# EAGLE board core (EAGLE 9.6.2), part 1 of 2
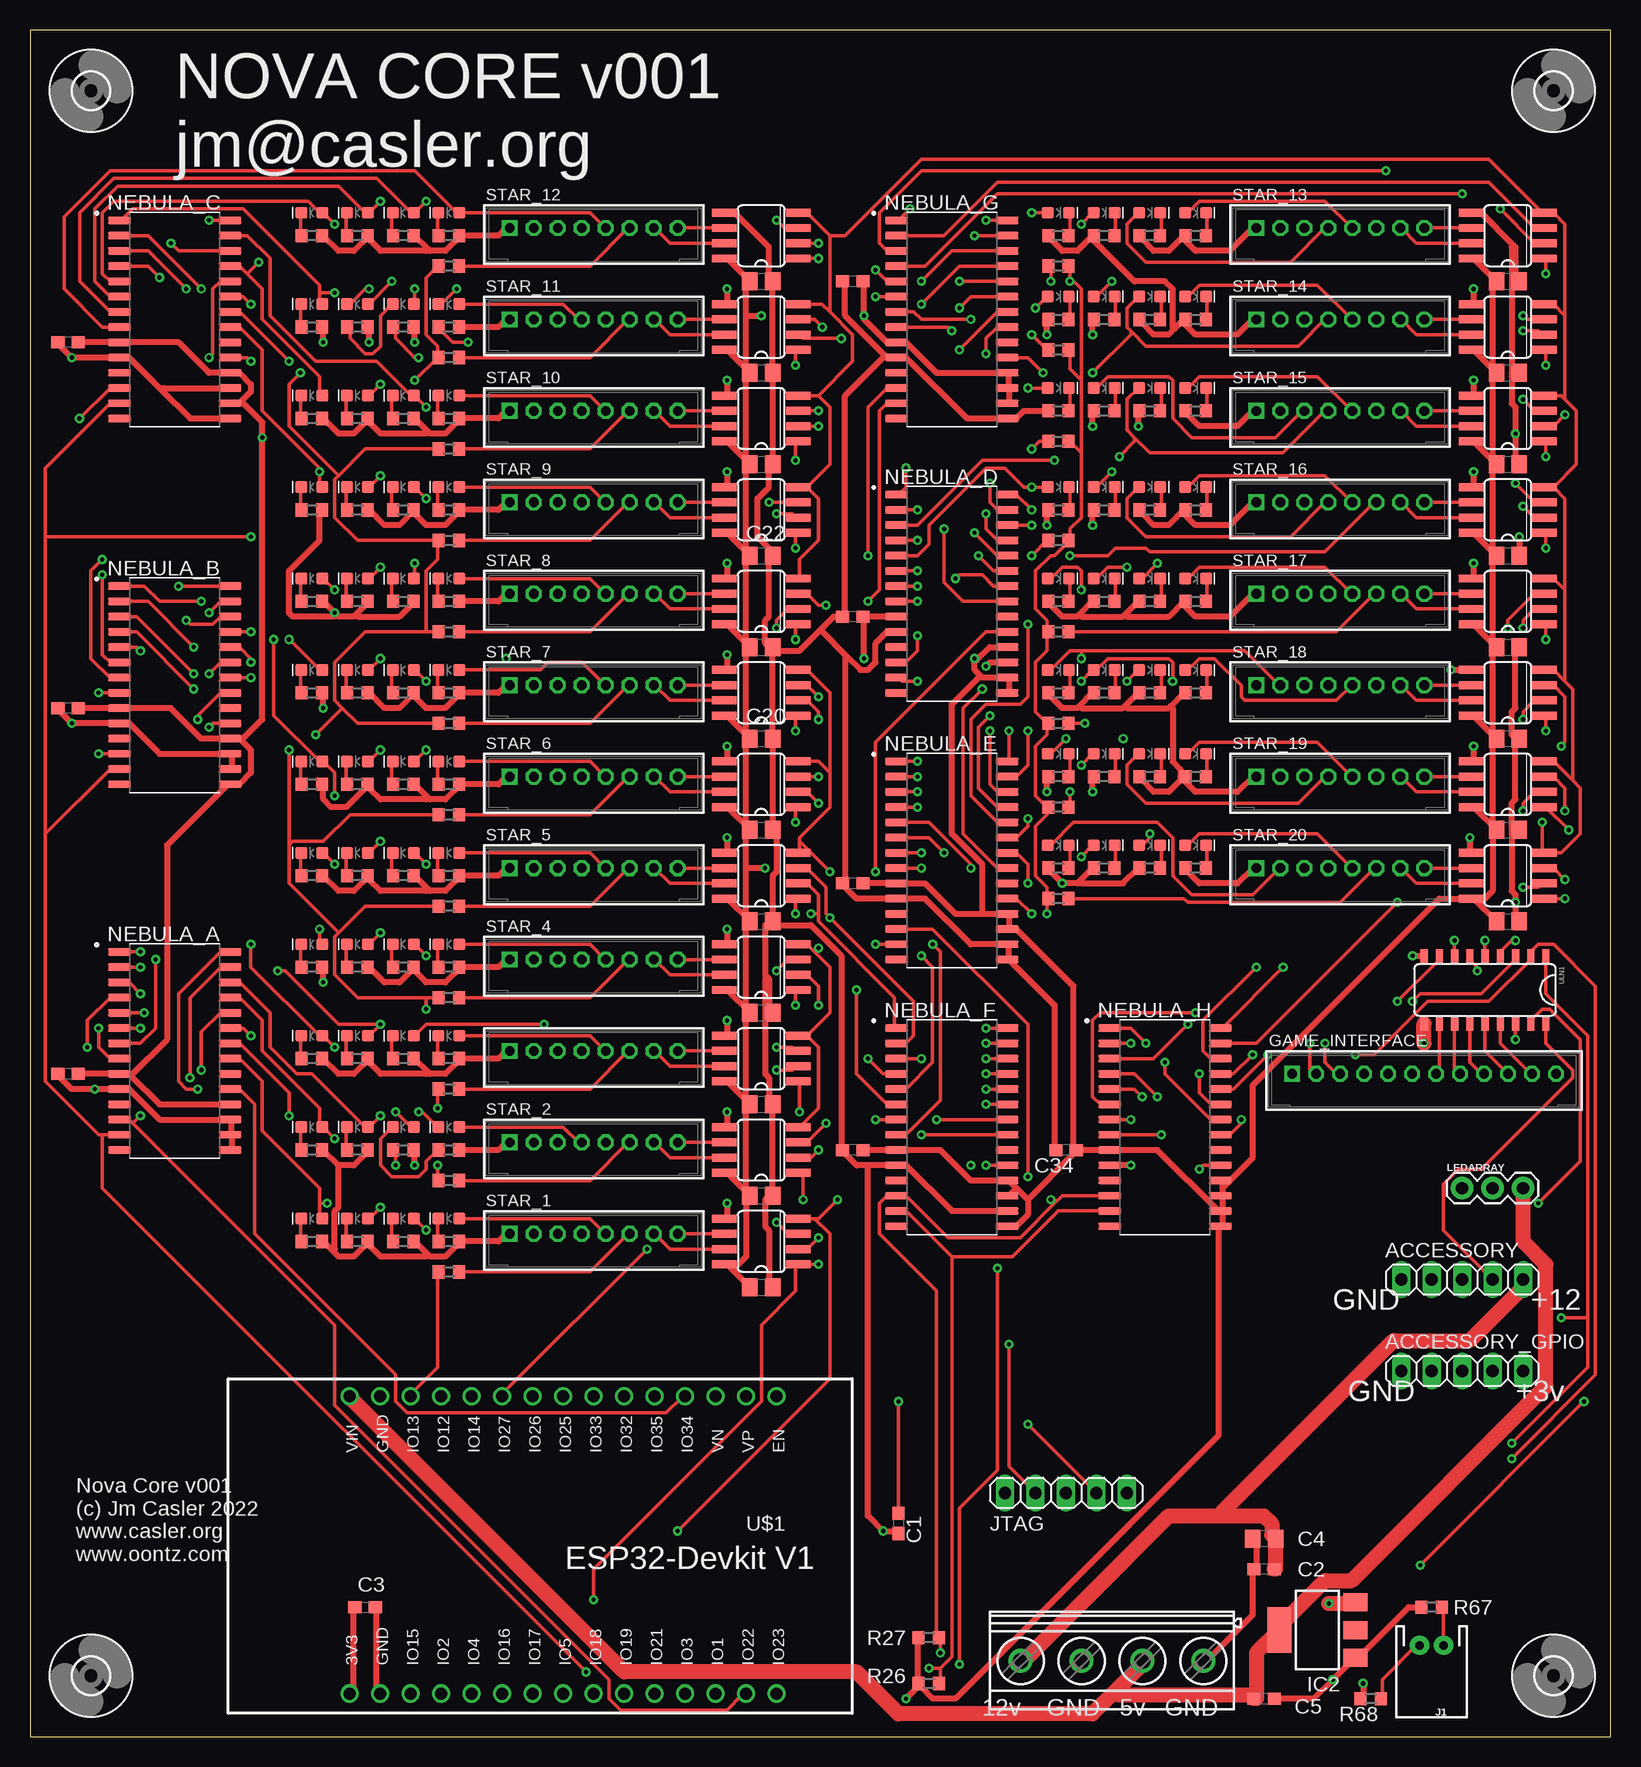
[diagram p5: board, top side]
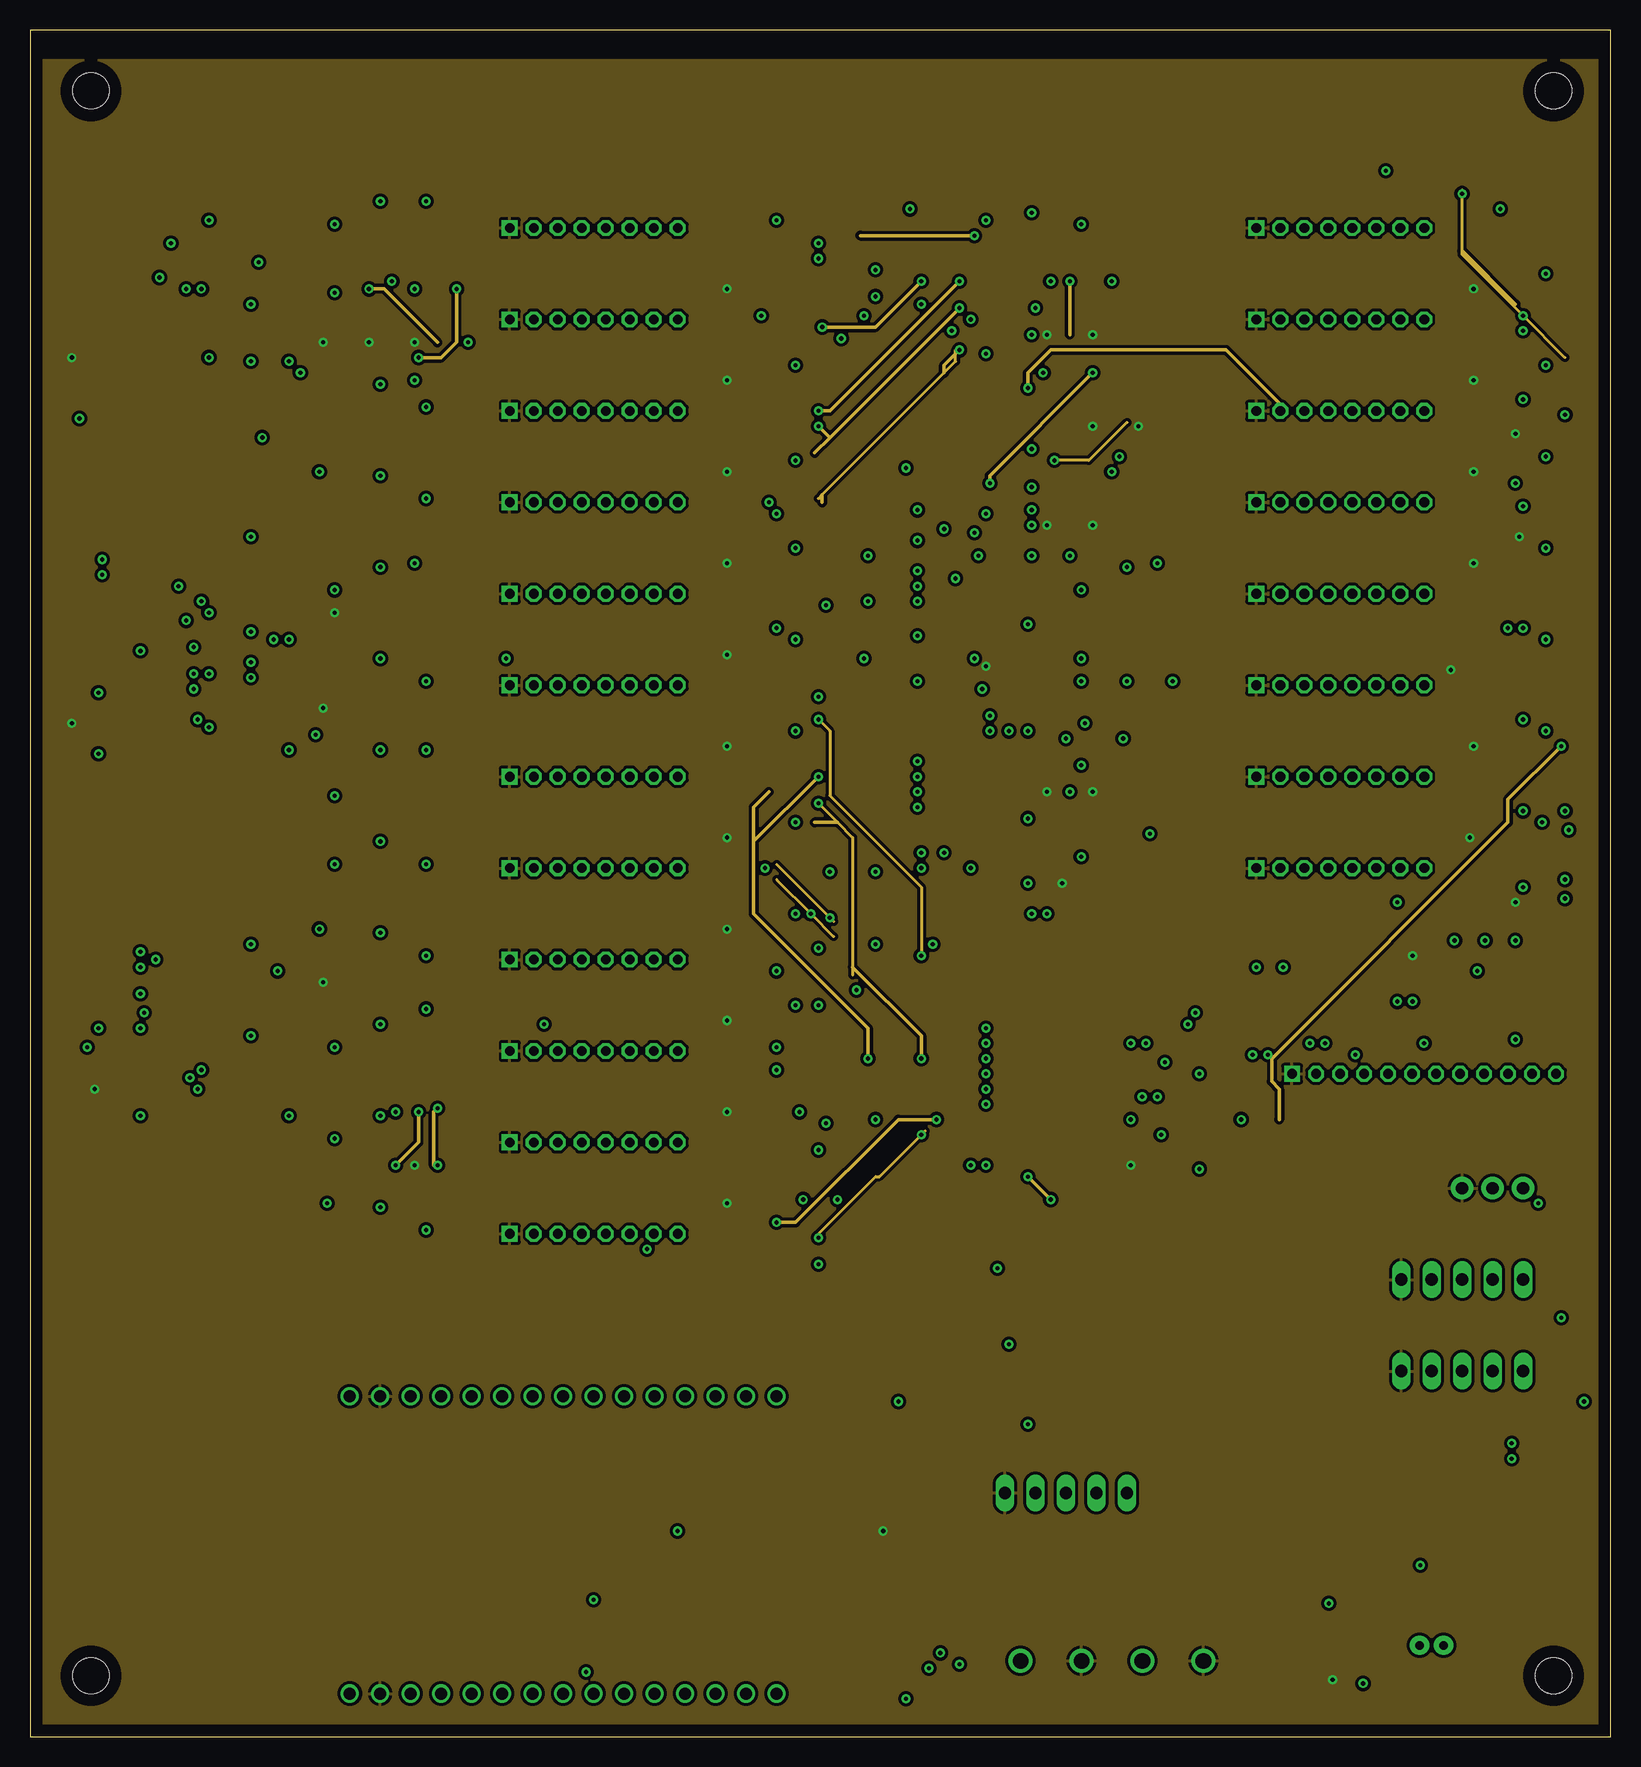
[diagram p6: board, inner layer $GND]
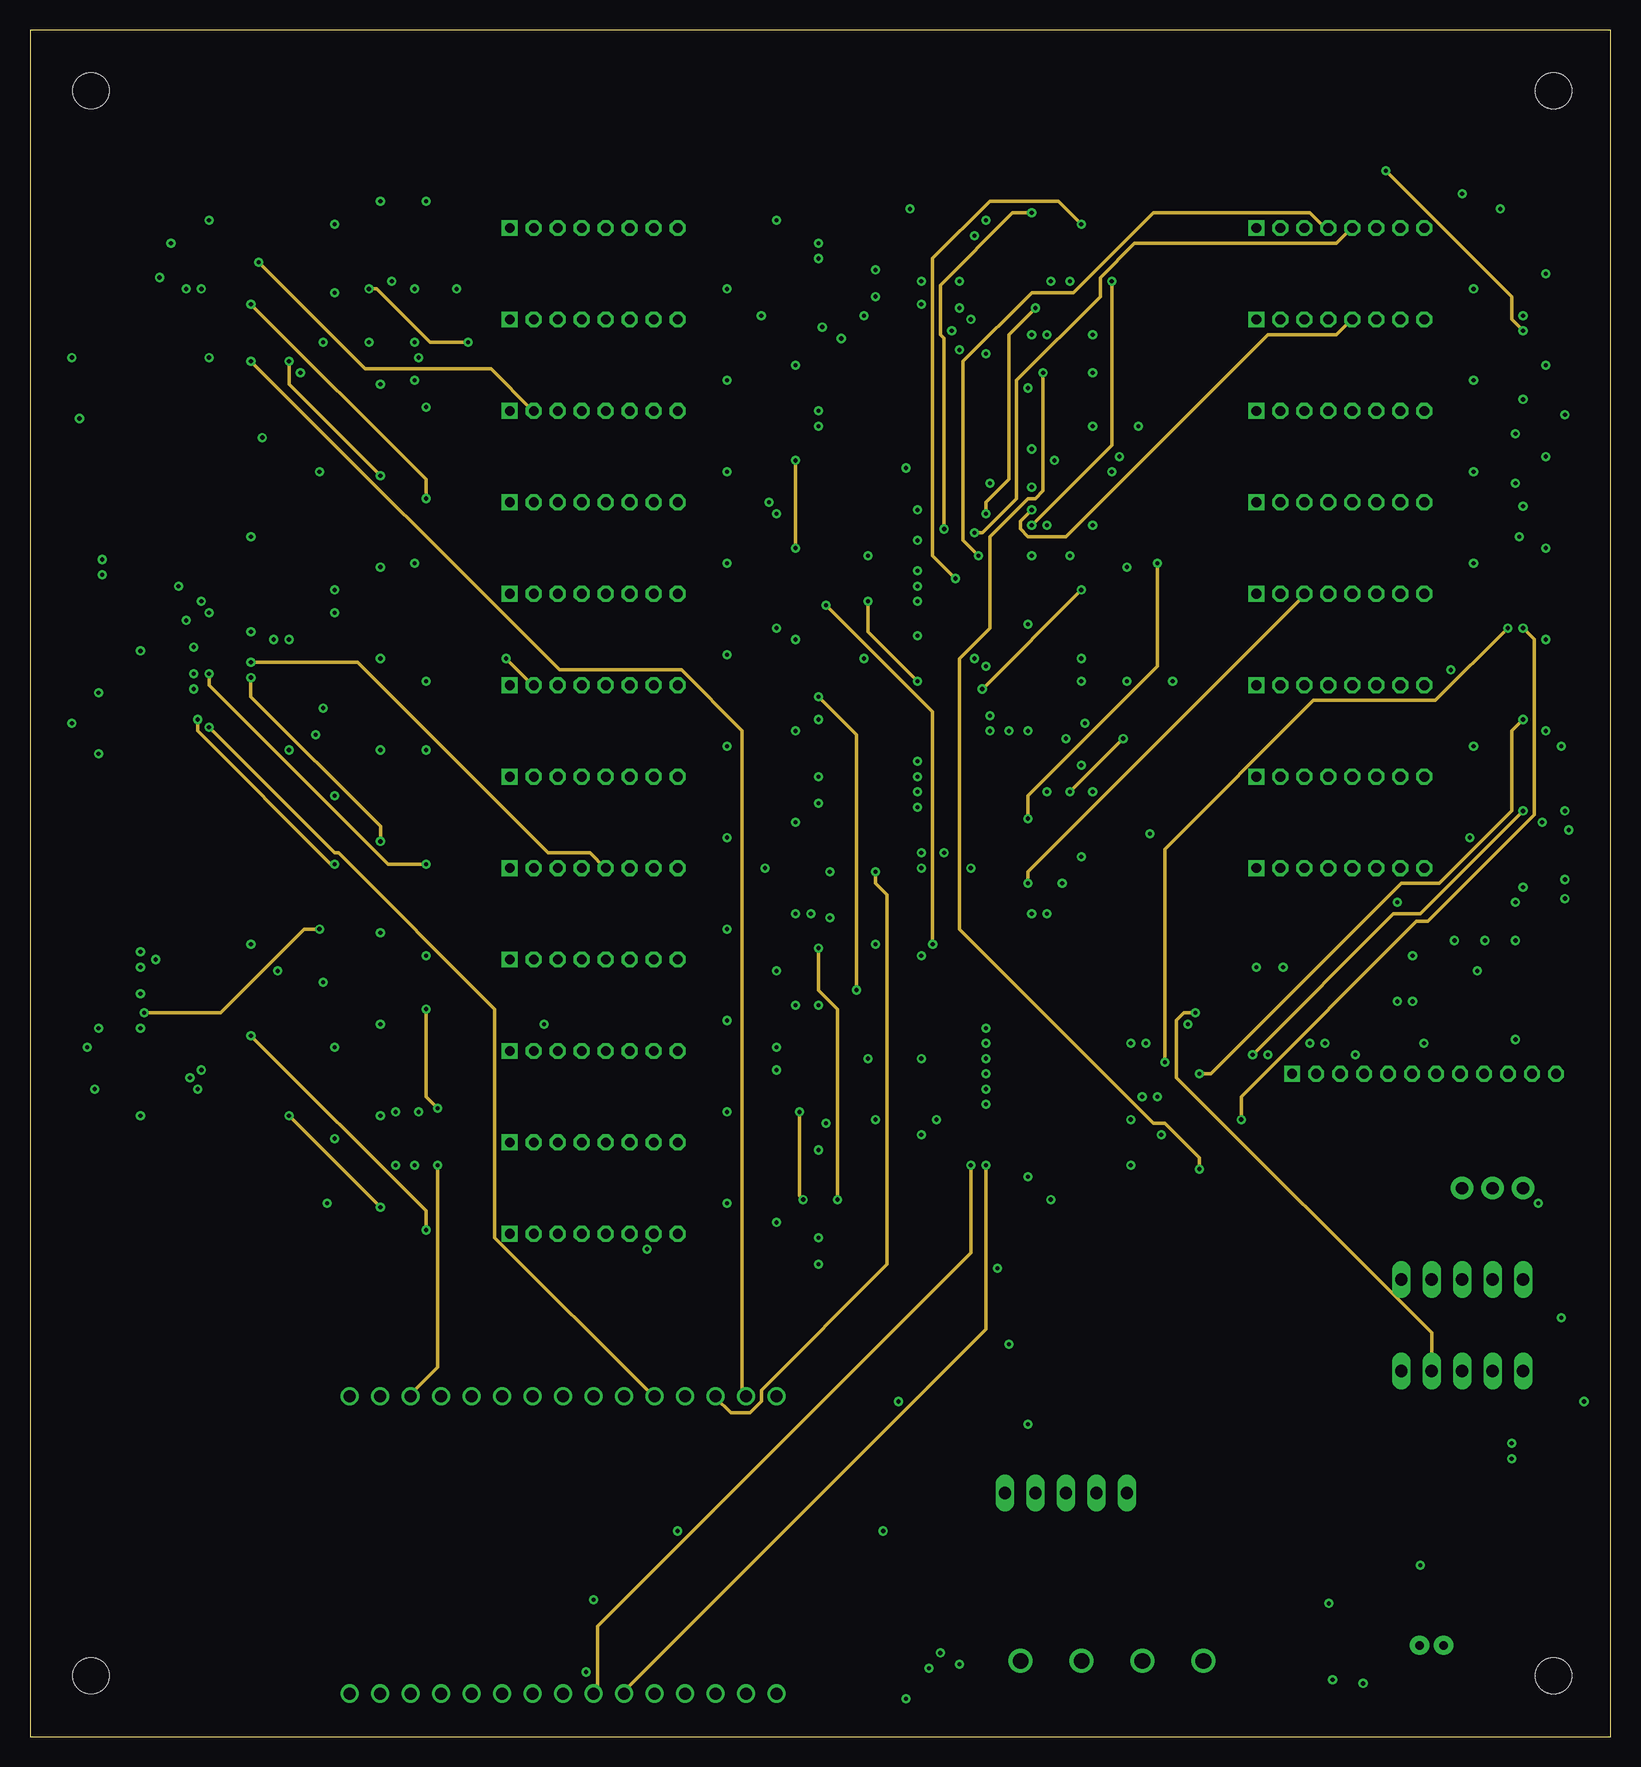
[diagram p7: board, inner layer SIGNAL3]
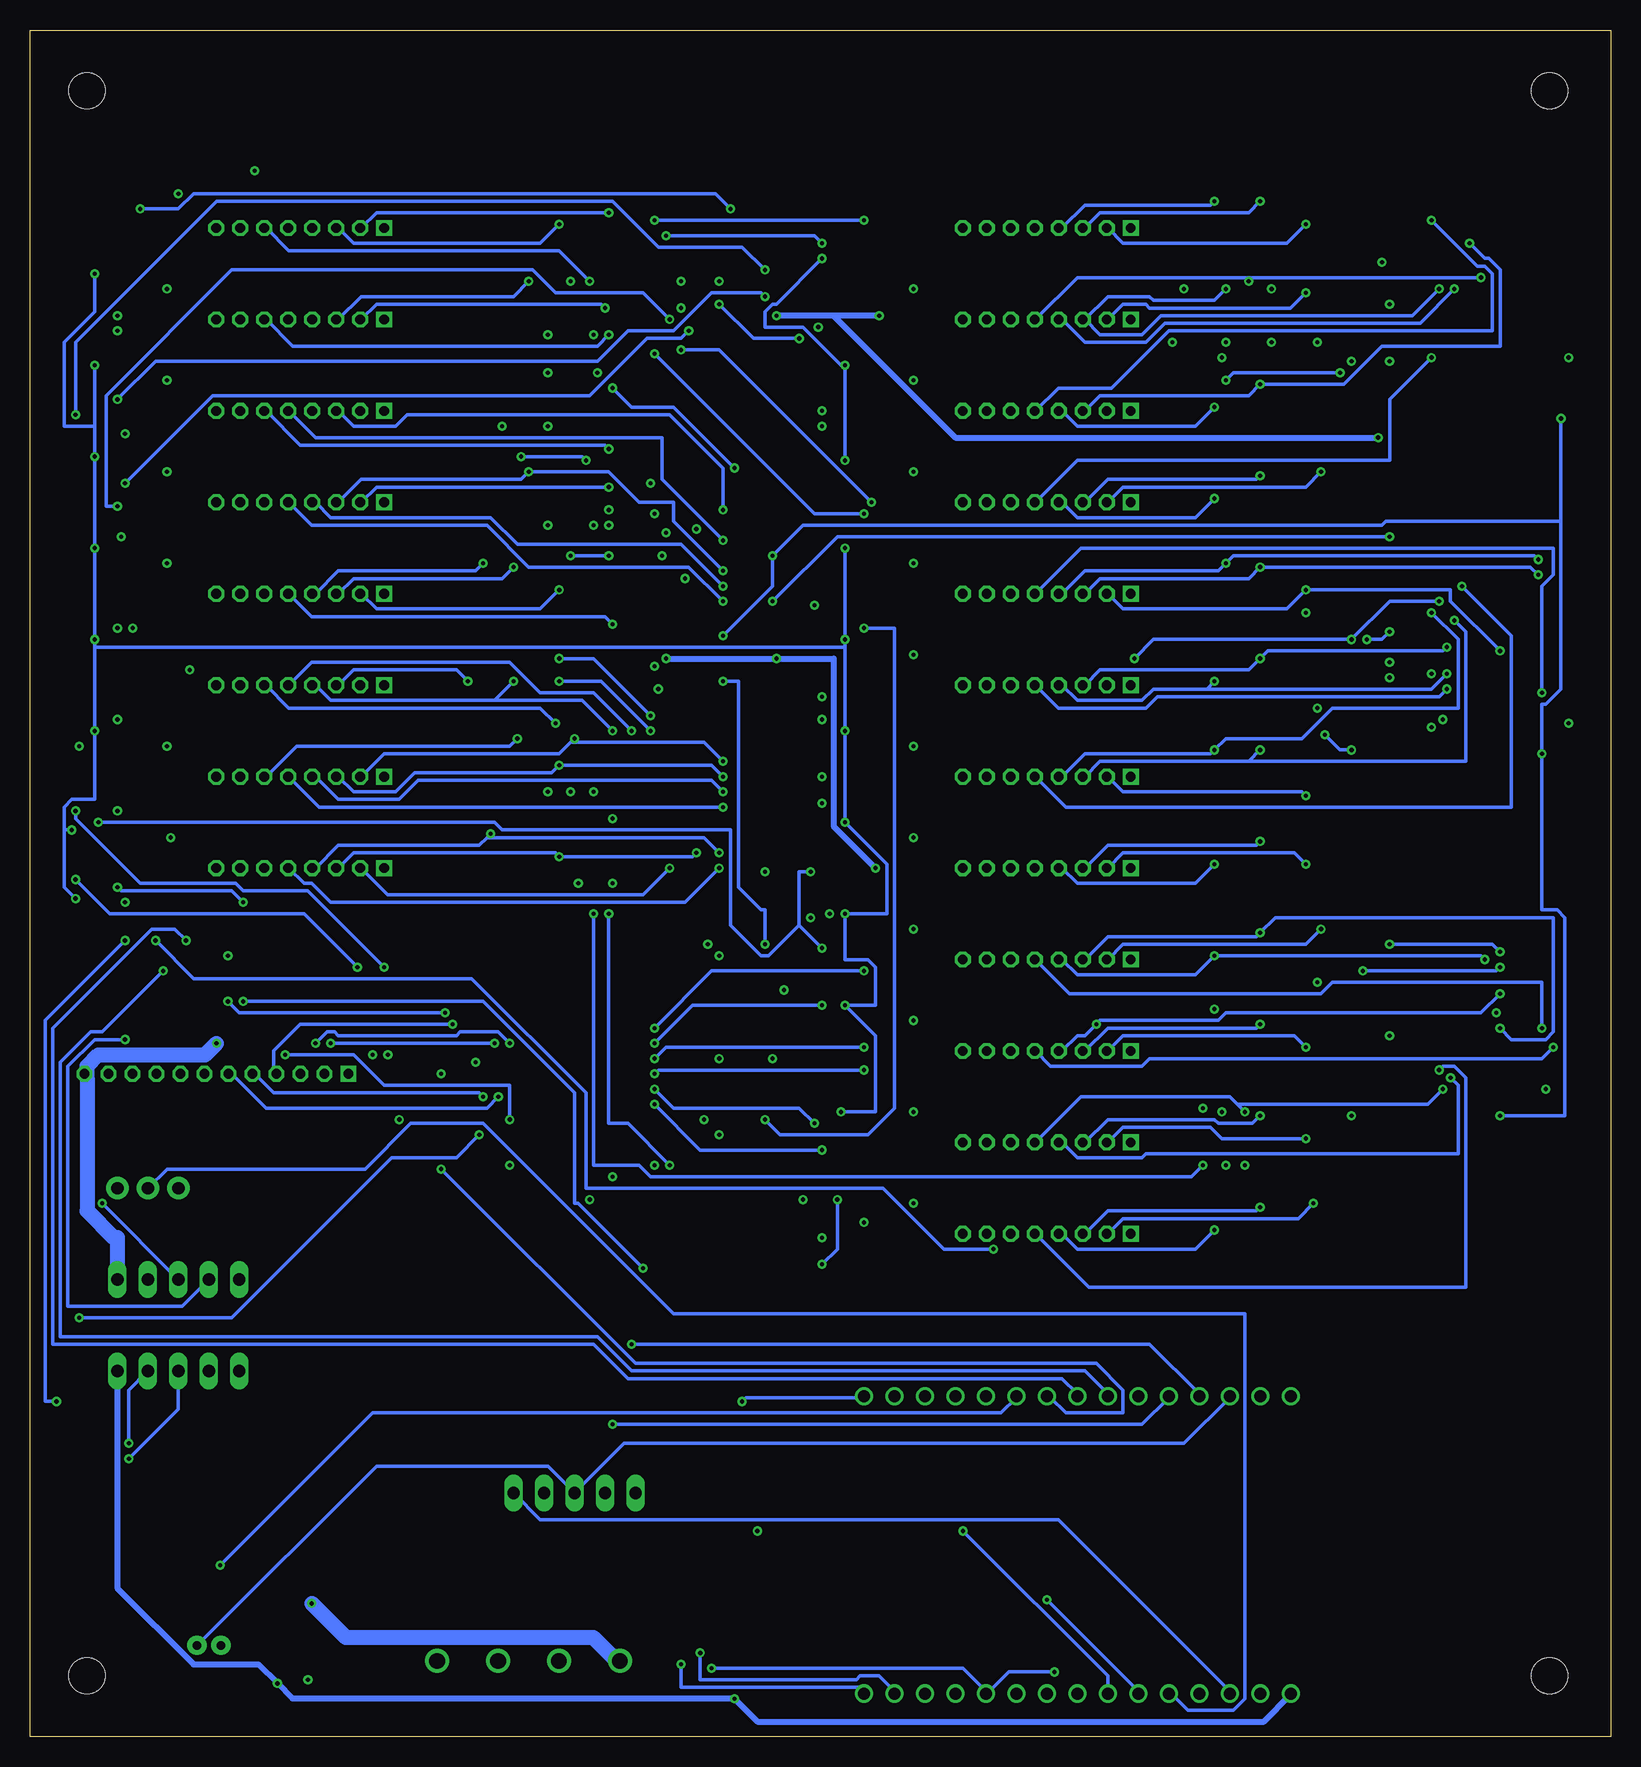
[diagram p8: board, bottom side, seen from below]

Size 131.75 x 142.23 mm. Coordinates in mm from the lower left corner, seen from the top.
Outline: 0,0 131.75,0 131.75,142.23 0,142.23 0,0
Copper layers (1+2*15+16): Top 0.035mm / dielectric 1.5mm / $GND 0.035mm / dielectric 0.15mm / SIGNAL3 0.035mm / dielectric 0.2mm / Bottom 0.035mm
Design rules "default *": minimum track width 6mil, minimum drill 0.35mm, track to track 6mil, track to pad 6mil, pad to pad 6mil, via to via 6mil, smd to smd 6mil, copper to edge 40mil, drill to drill 6mil, minimum pad ring 10mil, minimum via ring 8mil, stop-mask expansion 4mil, vias tented up to drill 20mil, thermal gap 10mil
Net classes: 0 default: width 0.305 mm, clearance 0.254 mm; 1 GND: width 0.508 mm, clearance 0.254 mm; 2 12V: width 1.27 mm, clearance 0.254 mm; 3 5V: width 1.27 mm, clearance 0.254 mm; 4 3V3: width 0.508 mm, clearance 0.254 mm; 5 12V_FUSED: width 0.635 mm, clearance 0.254 mm

## Footprints (pad centres in the part's own frame; a part is rotated, then mirrored left to right if it is on the bottom)
1X05 = drill 1.016 long: 1 -5.08,0; 2 -2.54,0; 3 0,0; 4 2.54,0; 5 5.08,0
C0603 = smd 1.1 x 1: 1 -0.85,0; 2 0.85,0
C0805 = smd 1.3 x 1.5: 1 -0.95,0; 2 0.95,0
LED-0603 = smd 1 x 1: A -0.877,0; C 0.877,0
B12B-PH-K = drill 0.813 square: 1 -11,0 | drill 0.813 octagon: 2 -9,0; 3 -7,0; 4 -5,0; 5 -3,0; 6 -1,0; 7 1,0; 8 3,0; 9 5,0; 10 7,0; 11 9,0; 12 11,0
3,0 = hole 3: 0,0
SO08 = smd 0.66 x 2.032: 1 -1.905,-3.073; 2 -0.635,-3.073; 3 0.635,-3.073; 4 1.905,-3.073; 5 1.905,3.073; 6 0.635,3.073; 7 -0.635,3.073; 8 -1.905,3.073
SOT223 = smd 1.5 x 2: 1 -2.3,-3.15; 2 0,-3.15; 3 2.3,-3.15 | smd 3.8 x 2: 4 0,3.15
JST-2-PTH = drill 0.7 pad 1.6: 1 -1,0; 2 1,0
1X03 = drill 1.016 pad 1.88: 1 0,0; 2 2.54,0; 3 5.08,0
SOIC127P1030X265-28N = smd 1.9 x 0.6: 1 -4.605,8.255; 2 -4.605,6.985; 3 -4.605,5.715; 4 -4.605,4.445; 5 -4.605,3.175; 6 -4.605,1.905; 7 -4.605,0.635; 8 -4.605,-0.635; 9 -4.605,-1.905; 10 -4.605,-3.175; 11 -4.605,-4.445; 12 -4.605,-5.715; 13 -4.605,-6.985; 14 -4.605,-8.255; 15 4.605,-8.255; 16 4.605,-6.985; 17 4.605,-5.715; 18 4.605,-4.445; 19 4.605,-3.175; 20 4.605,-1.905; 21 4.605,-0.635; 22 4.605,0.635; 23 4.605,1.905; 24 4.605,3.175; 25 4.605,4.445; 26 4.605,5.715; 27 4.605,6.985; 28 4.605,8.255
MKDSN1,5/4-5,08 = drill 1.3 pad 2: 1 -7.641,0.025; 2 -2.561,0.025; 3 2.519,0.025; 4 7.599,0.025
R0603 = smd 1 x 1.1: 1 -0.85,0; 2 0.85,0
B8B-PH-K = drill 0.813 square: 1 -7,0 | drill 0.813 octagon: 2 -5,0; 3 -3,0; 4 -1,0; 5 1,0; 6 3,0; 7 5,0; 8 7,0
ESP32-DEVKITV1 = drill 1 pad 1.422: 1 -22.87,-13.54; 2 -20.33,-13.54; 3 -17.79,-13.54; 4 -15.25,-13.54; 5 -12.71,-13.54; 6 -10.17,-13.54; 7 -7.63,-13.54; 8 -5.09,-13.54; 9 -2.55,-13.54; 10 -0.01,-13.54; 11 2.53,-13.54; 12 5.07,-13.54; 13 7.61,-13.54; 14 10.15,-13.54; 15 12.69,-13.54; 16 12.69,11.23; 17 10.15,11.23; 18 7.61,11.23; 19 5.07,11.23; 20 2.53,11.23; 21 -0.01,11.23; 22 -2.55,11.23; 23 -5.09,11.23; 24 -7.63,11.23; 25 -10.17,11.23; 26 -12.71,11.23; 27 -15.25,11.23; 28 -17.79,11.23; 29 -20.33,11.23; 30 -22.87,11.23
SO018 = smd 0.6 x 1.2: 1 -5.08,-2.8; 2 -3.81,-2.8; 3 -2.54,-2.8; 4 -1.27,-2.8; 5 0,-2.8; 6 1.27,-2.8; 7 2.54,-2.8; 8 3.81,-2.8; 9 5.08,-2.8; 10 5.08,2.8; 11 3.81,2.8; 12 2.54,2.8; 13 1.27,2.8; 14 0,2.8; 15 -1.27,2.8; 16 -2.54,2.8; 17 -3.81,2.8; 18 -5.08,2.8

## Placement (x,y rotation side)
ACCESSORY  [1X05]  119.38,38.1 0 top
ACCESSORY_GPIO  [1X05]  119.38,30.48 0 top
C1  10uf  [C0603]  72.39,17.78 270 top
C2  10uf  [C0603]  102.87,13.97 180 top
C3  10uf  [C0603]  27.94,10.79 0 top
C4  1uf  [C0805]  102.87,16.51 180 top
C5  10uf  [C0603]  102.87,3.17 0 top
C7  10uf  [C0603]  68.58,71.12 180 top
C8  10uf  [C0603]  3.17,55.24 180 top
C9  10uf  [C0603]  3.17,116.2 180 top
C10  10uf  [C0603]  3.17,85.72 180 top
C11  10uf  [C0603]  68.58,93.34 180 top
C12  10uf  [C0603]  68.58,48.9 180 top
C13  10uf  [C0603]  68.58,121.28 180 top
C14  1uf  [C0805]  60.96,37.47 0 top
C15  1uf  [C0805]  60.96,45.09 0 top
C16  1uf  [C0805]  60.96,52.7 0 top
C17  1uf  [C0805]  60.96,60.33 0 top
C18  1uf  [C0805]  60.96,67.94 0 top
C19  1uf  [C0805]  60.96,75.56 0 top
C20  1uf  [C0805]  60.96,83.19 0 top
C21  1uf  [C0805]  60.96,90.81 0 top
C22  1uf  [C0805]  60.96,98.42 0 top
C23  1uf  [C0805]  60.96,106.05 0 top
C24  1uf  [C0805]  60.96,113.67 0 top
C25  1uf  [C0805]  60.96,121.28 0 top
C26  1uf  [C0805]  123.19,67.94 0 top
C27  1uf  [C0805]  123.19,75.56 0 top
C28  1uf  [C0805]  123.19,83.19 0 top
C29  1uf  [C0805]  123.19,90.81 0 top
C30  1uf  [C0805]  123.19,98.42 0 top
C31  1uf  [C0805]  123.19,106.05 0 top
C32  1uf  [C0805]  123.19,113.67 0 top
C33  1uf  [C0805]  123.19,121.28 0 top
C34  10uf  [C0603]  86.36,48.9 180 top
D1  [LED-0603]  85.72,127 0 top
D2  [LED-0603]  23.5,43.18 180 top
D3  [LED-0603]  27.3,43.18 180 top
D4  [LED-0603]  31.11,43.18 180 top
D5  [LED-0603]  34.92,43.18 180 top
D6  [LED-0603]  23.5,50.8 180 top
D7  [LED-0603]  27.3,50.8 180 top
D8  [LED-0603]  34.92,50.8 180 top
D9  [LED-0603]  31.11,50.8 180 top
D10  [LED-0603]  23.5,58.42 180 top
D11  [LED-0603]  27.3,58.42 180 top
D12  [LED-0603]  31.11,58.42 180 top
D13  [LED-0603]  34.92,58.42 180 top
D14  [LED-0603]  23.5,66.04 180 top
D15  [LED-0603]  27.3,66.04 180 top
D16  [LED-0603]  31.11,66.04 180 top
D17  [LED-0603]  34.92,66.04 180 top
D18  [LED-0603]  23.5,73.66 180 top
D19  [LED-0603]  27.3,73.66 180 top
D20  [LED-0603]  31.11,73.66 180 top
D21  [LED-0603]  34.92,73.66 180 top
D22  [LED-0603]  23.5,81.28 180 top
D23  [LED-0603]  27.3,81.28 180 top
D24  [LED-0603]  31.11,81.28 180 top
D25  [LED-0603]  34.92,81.28 180 top
D26  [LED-0603]  23.5,88.9 180 top
D27  [LED-0603]  27.3,88.9 180 top
D28  [LED-0603]  31.11,88.9 180 top
D29  [LED-0603]  34.92,88.9 180 top
D30  [LED-0603]  23.5,96.52 180 top
D31  [LED-0603]  27.3,96.52 180 top
D32  [LED-0603]  31.11,96.52 180 top
D33  [LED-0603]  34.92,96.52 180 top
D34  [LED-0603]  23.5,104.14 180 top
D35  [LED-0603]  27.3,104.14 180 top
D36  [LED-0603]  31.11,104.14 180 top
D37  [LED-0603]  34.92,104.14 180 top
D38  [LED-0603]  23.5,111.76 180 top
D39  [LED-0603]  27.3,111.76 180 top
D40  [LED-0603]  31.11,111.76 180 top
D41  [LED-0603]  34.92,111.76 180 top
D42  [LED-0603]  23.5,119.38 180 top
D43  [LED-0603]  31.11,119.38 180 top
D44  [LED-0603]  34.92,119.38 180 top
D45  [LED-0603]  27.3,119.38 180 top
D46  [LED-0603]  23.5,127 180 top
D47  [LED-0603]  27.3,127 180 top
D48  [LED-0603]  31.11,127 180 top
D49  [LED-0603]  34.92,127 180 top
D50  [LED-0603]  89.53,127 0 top
D51  [LED-0603]  93.34,127 0 top
D52  [LED-0603]  97.16,127 0 top
D53  [LED-0603]  85.72,120.02 0 top
D54  [LED-0603]  89.53,120.02 0 top
D55  [LED-0603]  93.34,120.02 0 top
D56  [LED-0603]  97.16,120.02 0 top
D57  [LED-0603]  85.72,112.39 0 top
D58  [LED-0603]  89.53,112.39 0 top
D59  [LED-0603]  93.34,112.39 0 top
D60  [LED-0603]  97.16,112.39 0 top
D61  [LED-0603]  85.72,104.14 0 top
D62  [LED-0603]  89.53,104.14 0 top
D63  [LED-0603]  93.34,104.14 0 top
D64  [LED-0603]  97.16,104.14 0 top
D65  [LED-0603]  85.72,96.52 0 top
D66  [LED-0603]  89.53,96.52 0 top
D67  [LED-0603]  93.34,96.52 0 top
D68  [LED-0603]  97.16,96.52 0 top
D69  [LED-0603]  85.72,88.9 0 top
D70  [LED-0603]  89.53,88.9 0 top
D71  [LED-0603]  93.34,88.9 0 top
D72  [LED-0603]  97.16,88.9 0 top
D73  [LED-0603]  85.72,81.92 0 top
D74  [LED-0603]  89.53,81.92 0 top
D75  [LED-0603]  93.34,81.92 0 top
D76  [LED-0603]  97.16,81.92 0 top
D77  [LED-0603]  85.72,74.3 0 top
D78  [LED-0603]  89.53,74.3 0 top
D79  [LED-0603]  93.34,74.3 0 top
D80  [LED-0603]  97.16,74.3 0 top
GAME_INTERFACE  B12B-PH-K  [B12B-PH-K]  116.2,55.24 0 top
H1  MOUNT-HOLE3.0  [3,0]  127,5.08 0 top
H2  MOUNT-HOLE3.0  [3,0]  127,137.16 0 top
H3  MOUNT-HOLE3.0  [3,0]  5.08,137.16 0 top
H4  MOUNT-HOLE3.0  [3,0]  5.08,5.08 0 top
IC1  MAX481CSA  [SO08]  60.96,41.27 90 top
IC2  LD117AS12TR  [SOT223]  107.31,8.89 90 top
IC3  MAX481CSA  [SO08]  60.96,48.9 90 top
IC4  MAX481CSA  [SO08]  60.96,56.52 90 top
IC5  MAX481CSA  [SO08]  60.96,64.14 90 top
IC6  MAX481CSA  [SO08]  60.96,71.75 90 top
IC7  MAX481CSA  [SO08]  60.96,79.38 90 top
IC8  MAX481CSA  [SO08]  60.96,87 90 top
IC9  MAX481CSA  [SO08]  60.96,94.61 90 top
IC10  MAX481CSA  [SO08]  60.96,102.23 90 top
IC11  MAX481CSA  [SO08]  60.96,109.86 90 top
IC12  MAX481CSA  [SO08]  60.96,117.47 90 top
IC13  MAX481CSA  [SO08]  60.96,125.09 90 top
IC14  MAX481CSA  [SO08]  123.19,125.09 90 top
IC15  MAX481CSA  [SO08]  123.19,117.47 90 top
IC16  MAX481CSA  [SO08]  123.19,109.86 90 top
IC17  MAX481CSA  [SO08]  123.19,102.23 90 top
IC18  MAX481CSA  [SO08]  123.19,94.61 90 top
IC19  MAX481CSA  [SO08]  123.19,87 90 top
IC20  MAX481CSA  [SO08]  123.19,79.38 90 top
IC21  MAX481CSA  [SO08]  123.19,71.75 90 top
J1  [JST-2-PTH]  116.84,7.62 180 top
JTAG  [1X05]  86.36,20.32 0 top
LEDARRAY  [1X03]  119.38,45.72 0 top
NEBULA_A  MCP23017-E/SO  [SOIC127P1030X265-28N]  12.06,57.15 0 top
NEBULA_B  MCP23017-E/SO  [SOIC127P1030X265-28N]  12.06,87.63 0 top
NEBULA_C  MCP23017-E/SO  [SOIC127P1030X265-28N]  12.06,118.11 0 top
NEBULA_D  MCP23017-E/SO  [SOIC127P1030X265-28N]  76.83,95.25 0 top
NEBULA_E  MCP23017-E/SO  [SOIC127P1030X265-28N]  76.83,73.03 0 top
NEBULA_F  MCP23017-E/SO  [SOIC127P1030X265-28N]  76.83,50.8 0 top
NEBULA_G  MCP23017-E/SO  [SOIC127P1030X265-28N]  76.83,118.11 0 top
NEBULA_H  MCP23017-E/SO  [SOIC127P1030X265-28N]  94.61,50.8 0 top
POWER_IN  MKDSN1,5/4-5,08  [MKDSN1,5/4-5,08]  90.17,6.35 180 top
R3  10k  [R0603]  23.5,41.27 180 top
R4  10k  [R0603]  27.3,41.27 180 top
R5  10k  [R0603]  31.11,41.27 180 top
R6  10k  [R0603]  34.92,41.27 180 top
R7  10k  [R0603]  23.5,48.9 180 top
R8  10k  [R0603]  27.3,48.9 180 top
R9  10k  [R0603]  31.11,48.9 180 top
R10  10k  [R0603]  34.92,48.9 180 top
R11  10k  [R0603]  23.5,56.52 180 top
R12  10k  [R0603]  27.3,56.52 180 top
R13  10k  [R0603]  31.11,56.52 180 top
R14  10k  [R0603]  34.92,56.52 180 top
R15  10k  [R0603]  23.5,64.14 180 top
R16  10k  [R0603]  27.3,64.14 180 top
R17  10k  [R0603]  31.11,64.14 180 top
R18  10k  [R0603]  34.92,64.14 180 top
R19  10k  [R0603]  23.5,71.75 180 top
R20  10k  [R0603]  27.3,71.75 180 top
R21  10k  [R0603]  31.11,71.75 180 top
R22  10k  [R0603]  34.92,71.75 180 top
R23  10k  [R0603]  23.5,79.38 180 top
R24  10k  [R0603]  27.3,79.38 180 top
R25  10k  [R0603]  31.11,79.38 180 top
R26  10k  [R0603]  74.93,4.45 180 top
R27  10k  [R0603]  74.93,8.26 180 top
R28  10k  [R0603]  34.92,79.38 180 top
R29  10k  [R0603]  23.5,87 180 top
R30  10k  [R0603]  27.3,87 180 top
R31  10k  [R0603]  31.11,87 180 top
R32  10k  [R0603]  34.92,87 180 top
R33  10k  [R0603]  23.5,94.61 180 top
R34  10k  [R0603]  27.3,94.61 180 top
R35  10k  [R0603]  31.11,94.61 180 top
R36  10k  [R0603]  34.92,94.61 180 top
R37  10k  [R0603]  23.5,102.23 180 top
R38  10k  [R0603]  27.3,102.23 180 top
R39  10k  [R0603]  31.11,102.23 180 top
R40  10k  [R0603]  34.92,102.23 180 top
R41  10k  [R0603]  23.5,109.86 180 top
R42  10k  [R0603]  27.3,109.86 180 top
R43  10k  [R0603]  31.11,109.86 180 top
R44  10k  [R0603]  34.92,109.86 180 top
R45  10k  [R0603]  23.5,117.47 180 top
R46  10k  [R0603]  27.3,117.47 180 top
R47  10k  [R0603]  31.11,117.47 180 top
R48  10k  [R0603]  34.92,117.47 180 top
R49  10k  [R0603]  23.5,125.09 180 top
R50  10k  [R0603]  27.3,125.09 180 top
R51  10k  [R0603]  31.11,125.09 180 top
R52  10k  [R0603]  34.92,125.09 180 top
R53  10k  [R0603]  85.72,125.09 0 top
R54  68  [R0603]  34.92,38.73 0 top
R55  68  [R0603]  34.92,46.35 0 top
R56  68  [R0603]  34.92,53.98 0 top
R57  68  [R0603]  34.92,61.59 0 top
R58  68  [R0603]  34.92,69.22 0 top
R59  68  [R0603]  34.92,76.83 0 top
R60  68  [R0603]  34.92,84.45 0 top
R61  68  [R0603]  34.92,92.08 0 top
R62  68  [R0603]  34.92,99.69 0 top
R63  68  [R0603]  34.92,107.31 0 top
R64  68  [R0603]  34.92,114.94 0 top
R65  68  [R0603]  34.92,122.56 0 top
R66  10k  [R0603]  89.53,125.09 0 top
R67  10k  [R0603]  116.84,10.79 180 top
R68  68  [R0603]  111.76,3.17 180 top
R69  10k  [R0603]  93.34,125.09 0 top
R70  10k  [R0603]  97.16,125.09 0 top
R71  10k  [R0603]  85.72,118.11 0 top
R72  10k  [R0603]  89.53,118.11 0 top
R73  10k  [R0603]  93.34,118.11 0 top
R74  10k  [R0603]  97.16,118.11 0 top
R75  10k  [R0603]  85.72,110.49 0 top
R76  10k  [R0603]  89.53,110.49 0 top
R77  10k  [R0603]  93.34,110.49 0 top
R78  10k  [R0603]  97.16,110.49 0 top
R79  10k  [R0603]  85.72,102.23 0 top
R80  10k  [R0603]  89.53,102.23 0 top
R81  10k  [R0603]  93.34,102.23 0 top
R82  10k  [R0603]  97.16,102.23 0 top
R83  68  [R0603]  85.72,122.56 180 top
R84  68  [R0603]  85.72,115.57 180 top
R85  68  [R0603]  85.72,107.95 180 top
R86  68  [R0603]  85.72,99.69 180 top
R87  10k  [R0603]  85.72,94.61 0 top
R88  10k  [R0603]  89.53,94.61 0 top
R89  10k  [R0603]  93.34,94.61 0 top
R90  10k  [R0603]  97.16,94.61 0 top
R91  10k  [R0603]  85.72,87 0 top
R92  10k  [R0603]  89.53,87 0 top
R93  10k  [R0603]  93.34,87 0 top
R94  10k  [R0603]  97.16,87 0 top
R95  10k  [R0603]  85.72,80.01 0 top
R96  10k  [R0603]  89.53,80.01 0 top
R97  10k  [R0603]  93.34,80.01 0 top
R98  10k  [R0603]  97.16,80.01 0 top
R99  10k  [R0603]  85.72,72.39 0 top
R100  10k  [R0603]  89.53,72.39 0 top
R101  10k  [R0603]  93.34,72.39 0 top
R102  10k  [R0603]  97.16,72.39 0 top
R103  68  [R0603]  85.72,92.08 0 top
R104  68  [R0603]  85.72,84.45 0 top
R105  68  [R0603]  85.72,77.47 0 top
R106  68  [R0603]  85.72,69.85 0 top
STAR_1  B8B-PH-K  [B8B-PH-K]  46.99,41.91 0 top
STAR_2  B8B-PH-K  [B8B-PH-K]  46.99,49.53 0 top
STAR_3  B8B-PH-K  [B8B-PH-K]  46.99,57.15 0 top
STAR_4  B8B-PH-K  [B8B-PH-K]  46.99,64.77 0 top
STAR_5  B8B-PH-K  [B8B-PH-K]  46.99,72.39 0 top
STAR_6  B8B-PH-K  [B8B-PH-K]  46.99,80.01 0 top
STAR_7  B8B-PH-K  [B8B-PH-K]  46.99,87.63 0 top
STAR_8  B8B-PH-K  [B8B-PH-K]  46.99,95.25 0 top
STAR_9  B8B-PH-K  [B8B-PH-K]  46.99,102.87 0 top
STAR_10  B8B-PH-K  [B8B-PH-K]  46.99,110.49 0 top
STAR_11  B8B-PH-K  [B8B-PH-K]  46.99,118.11 0 top
STAR_12  B8B-PH-K  [B8B-PH-K]  46.99,125.73 0 top
STAR_13  B8B-PH-K  [B8B-PH-K]  109.22,125.73 0 top
STAR_14  B8B-PH-K  [B8B-PH-K]  109.22,118.11 0 top
STAR_15  B8B-PH-K  [B8B-PH-K]  109.22,110.49 0 top
STAR_16  B8B-PH-K  [B8B-PH-K]  109.22,102.87 0 top
STAR_17  B8B-PH-K  [B8B-PH-K]  109.22,95.25 0 top
STAR_18  B8B-PH-K  [B8B-PH-K]  109.22,87.63 0 top
STAR_19  B8B-PH-K  [B8B-PH-K]  109.22,80.01 0 top
STAR_20  B8B-PH-K  [B8B-PH-K]  109.22,72.39 0 top
U$1  ESP32DEVKITV1  [ESP32-DEVKITV1]  49.53,17.14 0 top
ULN1  [SO018]  121.28,62.23 180 top

## Tracks (layer width: path | path; a pad name or v marks a point on that pad's centre or on a via)
4
  Bottom 0.305: LEDARRAY.2 120.33,47.31 103.82,47.31 100.01,51.12 93.98,51.12 78.11,35.24 30.48,35.24 30.48,3.17 31.43,2.22 35.24,2.22 36.51,3.49 U$1.5
12  (via drill 0.35)
  Top 0.305: v81.6,32.7 81.6,22.54 JTAG.2
  Bottom 0.305: v81.6,32.7 38.42,32.7 34.29,28.57 U$1.27
13  (via drill 0.35)
  Top 0.305: 84.77,69.85 84.77,70.8 83.82,71.75 83.82,75.88 84.77,76.83 84.77,77.47 | 84.77,84.45 84.77,83.5 83.82,82.55 83.82,78.42 84.77,77.47 | 84.77,77.47 R105.1 | 84.77,92.08 84.77,90.49 83.82,89.53 83.82,85.41 84.77,84.45 | 84.77,84.45 R104.1 | 86.68,99.69 86.68,100.65 87.63,101.6 87.63,107 | 87.63,107 86.68,107.95 R85.1 | 87.63,113.03 86.68,113.98 86.68,115.57 R84.1 | 87.63,107 87.63,113.03 | 86.68,121.6 86.68,122.56 R83.1 | 86.68,121.6 87.63,120.65 87.63,113.03 | 86.68,121.6 v86.68,121.28 | 84.77,92.08 84.77,93.03 83.82,93.98 83.82,97.16 85.09,98.42 85.41,98.42 86.68,99.69 | 84.77,92.08 R103.1 | 86.68,99.69 R86.1 | R67.1 117.79,10.79 117.79,7.62 J1.1 | 33.97,114.94 33.97,115.89 33.02,116.84 33.02,121.6 33.97,122.56 R65.1 | R60.1 27.3,84.45 26.04,85.72 | 26.04,85.72 25.4,86.36 25.4,89.53 27.94,92.08 33.02,92.08 | R61.1 33.02,92.08 | 33.97,99.69 33.97,98.11 33.02,97.16 33.02,92.08 | R63.1 27.94,107.31 25.72,105.09 | 25.72,105.09 25.4,104.78 25.4,101.6 27.3,99.69 33.97,99.69 | 33.97,99.69 R62.1 | v32.07,113.03 33.97,114.94 | v22.54,113.67 21.59,112.71 21.59,109.22 25.72,105.09 | 33.97,114.94 R64.1 | 33.02,61.59 27.3,61.59 25.4,63.5 25.4,66.67 25.72,66.99 | 33.02,61.59 R57.1 | 25.72,66.99 27.94,69.22 R58.1 | R59.1 26.67,76.83 24.45,74.61 21.91,74.61 21.59,74.3 | 21.59,74.3 21.59,71.12 25.72,66.99 | v33.97,47.62 33.97,46.35 R55.1 | v33.97,52.39 33.97,53.98 R56.1 | R54.1 33.97,38.73 33.97,30.8 31.75,28.57 U$1.28 | v33.02,60.64 33.02,61.59 | v23.81,83.5 26.04,85.72 | 21.59,74.3 v21.59,82.23 | v84.77,68.58 84.77,69.85 | 84.77,69.85 R106.1
  $GND 0.305: 86.68,116.84 v86.68,121.28 | v33.97,47.62 33.66,47.62 33.66,52.07 v33.97,52.39
  SIGNAL3 0.305: v33.97,47.62 33.97,30.8 31.75,28.57 U$1.28 | v33.02,60.64 33.02,53.34 v33.97,52.39
  Bottom 0.305: J1.1 117.79,7.62 102.87,22.54 88.58,22.54 JTAG.3 82.23,24.45 35.56,24.45 31.75,28.26 U$1.28 | v32.07,113.03 31.43,113.67 v22.54,113.67 | v23.81,83.5 22.54,82.23 v21.59,82.23 | v84.77,68.58 84.77,47.62 80.96,47.62 80.01,46.67 34.92,46.67 v33.97,47.62
14  (via drill 0.35)
  Top 0.305: JTAG.4 v83.19,26.04
  Bottom 0.305: v83.19,26.04 39.05,26.04 36.83,28.26 U$1.26
15
  Bottom 0.305: JTAG.5 89.22,18.1 46.04,18.1 31.75,3.81 U$1.3
16  (via drill 0.35)
  Top 0.305: v127.95,69.85 IC21.1 | v128.27,75.56 126.36,77.47 IC20.1 | v126.36,83.82 126.36,85.09 IC19.1 | v126.36,91.44 126.36,92.71 IC18.1 | v126.36,99.06 126.36,100.33 IC17.1 | v126.36,106.68 126.36,107.95 IC16.1 | v126.36,114.3 126.36,115.57 IC15.1 | v126.36,121.92 126.36,123.19 IC14.1 | v65.72,39.37 IC1.1 63.82,39.37 63.82,37.15 60.96,34.29 60.96,27.94 46.99,13.97 v46.99,11.43 | v64.45,44.77 64.45,46.67 64.14,46.99 IC3.1 | v64.14,52.07 64.14,54.61 IC4.1 | v63.82,60.96 63.82,62.23 IC5.1 | v63.82,68.58 63.82,69.85 IC6.1 | v63.82,76.2 63.82,77.47 IC7.1 | v63.82,83.82 63.82,85.09 IC8.1 | v63.82,91.44 63.82,92.71 IC9.1 | v63.82,99.06 63.82,100.33 IC10.1 | v63.82,106.36 63.82,107.95 IC11.1 | v63.82,114.3 63.82,115.57 IC12.1 | v65.72,123.19 IC13.1
  SIGNAL3 0.305: v64.14,52.07 64.14,45.09 v64.45,44.77 | v63.82,99.06 v63.82,106.36
  Bottom 0.305: v127.95,69.85 128.91,70.8 128.91,75.56 | v128.27,75.56 128.91,75.56 | 128.91,75.56 128.91,77.47 128.27,78.11 126.36,78.11 v126.36,83.82 126.36,90.81 | 126.36,90.81 v126.36,91.44 v126.36,99.06 v126.36,106.68 126.36,109.22 | 126.36,109.22 v126.36,114.3 | v126.36,121.92 126.36,118.75 128.91,116.2 128.91,109.22 126.36,109.22 | v65.72,39.37 64.45,40.64 v64.45,44.77 | v64.14,52.07 61.28,52.07 61.28,58.42 v63.82,60.96 61.28,60.96 61.28,64.14 61.91,64.77 63.82,64.77 v63.82,68.58 60.33,68.58 60.33,72.71 v63.82,76.2 v63.82,83.82 63.82,90.81 | 63.82,90.81 v63.82,91.44 v63.82,99.06 | v63.82,106.36 v63.82,114.3 64.14,114.3 67.31,117.47 70.48,117.47 70.48,118.75 69.85,119.38 69.53,119.38 v65.72,123.19 | v46.99,11.43 39.37,3.81 U$1.6 | 63.82,90.81 126.36,90.81
17  (via drill 0.35)
  Top 0.305: 64.77,58.42 65.72,57.47 65.72,52.39 64.14,50.8 IC3.4 | 64.77,58.42 IC4.4 64.14,58.42 | IC5.4 64.77,66.04 65.41,65.41 | 65.41,65.41 66.67,64.14 66.67,60.33 64.77,58.42 | 64.14,74.61 64.14,74.93 66.67,77.47 66.67,80.33 | 64.14,74.61 64.14,73.66 IC6.4 | 66.67,80.33 65.72,81.28 IC7.4 | IC8.4 64.77,88.9 66.67,87 66.67,80.33 | v65.72,65.72 65.41,65.41 | 64.14,74.61 v66.67,72.07 | 65.41,43.18 IC1.4 | 65.41,43.18 66.67,41.91 66.67,29.84 v53.98,17.14 | v67.31,44.77 65.72,43.18 65.41,43.18 | 64.77,104.14 65.72,103.19 65.72,99.69 64.14,98.11 64.14,96.52 IC9.4 | 64.77,104.14 IC10.4 64.14,104.14 | 65.72,111.76 IC11.4 | 65.72,111.76 66.67,110.81 66.67,106.05 64.77,104.14 | IC12.4 66.04,119.38 66.67,118.75 | 66.67,118.75 68.58,116.84 68.58,114.62 65.72,111.76 | IC13.4 64.77,127 66.67,125.09 | 66.67,118.75 66.67,125.09 | 128.59,79.69 127,81.28 IC20.4 | 128.59,79.69 129.22,79.06 129.22,75.25 127.64,73.66 IC21.4 126.05,73.66 v126.05,76.2 | IC19.4 127,88.9 127.95,87.95 | 127.95,87.95 128.59,87.31 128.59,79.69 | IC18.4 127,96.52 127.95,95.57 | 127.95,87.95 127.95,95.57 | 127,104.14 127.95,103.19 127.95,95.57 | IC16.4 127.64,111.76 127.95,111.44 | 127.95,111.44 128.91,110.49 128.91,106.05 127,104.14 | 127,104.14 IC17.4 | IC15.4 127,119.38 127.95,118.43 | 127.95,111.44 127.95,118.43 | 127.95,118.43 127.95,126.05 127,127 IC14.4 126.05,127 121.6,131.44 74.3,131.44 67.94,125.09 66.67,125.09
  SIGNAL3 0.305: v65.72,65.72 65.72,62.23 67.31,60.64 v67.31,44.77
  Bottom 0.305: 67.63,67.63 v65.72,65.72 | 67.63,67.63 67.63,72.07 v66.67,72.07 | v53.98,17.14 41.91,5.08 41.91,3.81 U$1.7 | 67.63,67.63 70.17,65.09 70.8,65.09 73.34,67.63 73.34,75.56 92.39,75.56 93.03,76.2 v126.05,76.2
18  (via drill 0.35)
  Top 0.305: NEBULA_E.19 82.23,69.85 v83.5,68.58
  SIGNAL3 0.305: v78.42,47.62 78.42,40.32 47.31,9.21 47.31,4.13 46.99,3.81 U$1.9
  Bottom 0.305: v83.5,68.58 83.5,51.12 81.92,51.12 v78.42,47.62
19  (via drill 0.35)
  Top 0.305: v79.69,47.62 NEBULA_F.19
  SIGNAL3 0.305: v79.69,47.62 79.69,33.97 49.53,3.81 U$1.10
21/SDA  (via drill 0.35)
  Top 0.305: 75.88,5.71 75.88,4.45 R26.1 | 75.88,5.71 76.83,6.67 76.83,40.01 | 76.83,40.01 73.03,43.81 NEBULA_F.13 | NEBULA_H.13 85.72,43.81 81.92,40.01 76.83,40.01 | 75.88,5.71 v74.93,5.71 | v70.48,66.04 NEBULA_E.13 | v73.98,87.95 72.71,87.95 72.39,88.27 NEBULA_D.13 | NEBULA_G.13 71.44,111.12 70.8,110.49 70.8,95.57 v69.85,94.61 | 6.03,50.16 5.71,50.16 1.27,54.61 1.27,75.25 | 6.03,50.16 NEBULA_A.13 | 1.27,75.25 6.67,80.64 NEBULA_B.13 | NEBULA_C.13 6.67,111.12 1.27,105.73 1.27,100.01 | 1.27,75.25 1.27,100.01 | 1.27,100.01 v18.41,100.01 | v46.35,5.4 6.03,45.72 6.03,50.16
  SIGNAL3 0.305: v69.85,94.61 69.85,92.08 v73.98,87.95
  Bottom 0.305: v74.93,5.71 53.98,5.71 52.07,3.81 U$1.11 51.75,3.81 50.16,5.4 v46.35,5.4 | v70.48,66.04 70.48,68.9 70.8,68.9 72.71,70.8 72.71,87.95 v73.98,87.95 | v69.85,94.61 64.45,100.01 v18.41,100.01
22/SCL  (via drill 0.35)
  Top 0.305: NEBULA_D.12 73.03,89.53 73.98,90.49 v73.98,91.76 | v69.85,98.42 69.85,110.81 71.44,112.39 NEBULA_G.12 | v5.71,81.92 NEBULA_B.12 | v4.13,109.86 6.67,112.39 NEBULA_C.12 | NEBULA_H.12 86.04,45.09 85.41,44.45 | 85.41,44.45 82.55,41.59 76.52,41.59 73.03,45.09 NEBULA_F.12 71.44,45.09 70.8,44.45 70.8,41.91 75.56,37.15 75.56,8.26 R27.1 75.88,8.26 v75.88,6.99 | NEBULA_E.12 75.25,67.31 83.19,59.37 v83.19,46.67 | 85.41,44.45 v85.09,44.77 | NEBULA_A.12 8.26,51.44 8.57,51.12 | 8.57,51.12 25.4,34.29 25.4,27.62 48.26,4.76 48.26,3.17 49.21,2.22 58.1,2.22 59.37,3.49 U$1.14 | 8.57,51.12 v9.21,51.75
  $GND 0.305: v85.09,44.77 v83.19,46.67
  Bottom 0.305: v73.98,91.76 69.85,95.89 v69.85,98.42 67.31,100.97 19.05,100.97 18.73,101.28 4.13,101.28 | v4.13,109.86 4.13,101.28 | 4.13,101.28 4.13,87.31 5.4,86.04 5.71,86.04 v5.71,81.92 5.71,68.9 4.45,68.9 3.81,68.26 3.81,51.75 v9.21,51.75 | v75.88,6.99 75.88,4.76 62.87,4.76 62.55,5.08 60.96,5.08 59.69,3.81 U$1.14
23  (via drill 0.35)
  Top 0.305: v113.98,61.28 117.47,64.77 ULN1.8 | v80.64,39.05 80.64,22.23 77.47,19.05 v77.47,6.03
  Bottom 0.305: v113.98,61.28 93.98,61.28 86.36,53.66 86.36,44.45 86.04,44.45 v80.64,39.05 | v77.47,6.03 77.47,4.13 62.55,4.13 62.23,3.81 U$1.15
25  (via drill 0.35)
  Top 0.305: v118.75,66.36 ULN1.7
  Bottom 0.305: v118.75,66.36 119.7,67.31 121.6,67.31 129.86,59.05 129.86,32.7 84.77,32.7 81.92,29.84 45.72,29.84 44.45,28.57 U$1.23
26  (via drill 0.35)
  Top 0.305: v120.65,63.82 120.65,64.14 120.02,64.77 ULN1.6
  Bottom 0.305: v120.65,63.82 125.73,58.74 126.68,58.74 129.22,56.2 129.22,33.34 84.45,33.34 81.6,30.48 43.81,30.48 41.91,28.57 U$1.24
27  (via drill 0.35)
  Top 0.305: v121.28,66.36 ULN1.5 | v51.44,40.64 39.37,28.57 U$1.25
  Bottom 0.305: v121.28,66.36 118.11,63.18 94.93,63.18 85.41,53.66 85.41,45.72 60.64,45.72 55.56,40.64 v51.44,40.64
32  (via drill 0.35)
  Top 0.305: ULN1.4 122.56,65.41 123.51,66.36 v123.83,66.36 | v115.89,14.29 v129.54,27.94
  Bottom 0.305: v123.83,66.36 130.49,59.69 130.49,27.94 v129.54,27.94 | v115.89,14.29 103.19,26.99 50.8,26.99 49.53,28.26 U$1.21
33  (via drill 0.35)
  Top 0.305: NEBULA_H.19 97.79,47.62 v97.47,47.31 | NEBULA_G.19 83.19,114.94 v84.45,113.67
  SIGNAL3 0.305: v84.45,113.67 84.45,103.82 83.82,103.19 83.19,103.19 80.01,100.01 80.01,92.39 77.47,89.85 77.47,67.31 93.66,51.12 94.61,51.12 97.47,48.26 v97.47,47.31
  Bottom 0.305: v97.47,47.31 81.28,31.11 42.86,31.11 40.64,28.89 40.64,26.99 45.4,26.99 46.67,28.26 U$1.22
34
  Top 0.305: NEBULA_A.19 17.46,53.98 18.73,52.7 18.73,41.91 30.48,30.16 30.48,27.94 31.43,26.99 53.02,26.99 54.29,28.26 U$1.19
35  (via drill 0.35)
  Top 0.305: NEBULA_B.19 15.24,84.45 v14.92,84.14
  SIGNAL3 0.305: v14.92,84.14 25.4,73.66 25.72,73.66 38.73,60.64 38.73,41.59 51.75,28.57 U$1.20
36  (via drill 0.35)
  Top 0.305: NEBULA_C.19 18.1,114.94 v18.41,114.62
  SIGNAL3 0.305: v18.41,114.62 44.13,88.9 54.29,88.9 59.37,83.82 59.37,28.57 U$1.17
39  (via drill 0.35)
  Top 0.305: NEBULA_D.19 79.69,92.08 70.48,82.87 v70.48,72.07
  SIGNAL3 0.305: v70.48,72.07 70.48,71.12 71.44,70.17 71.44,39.37 60.96,28.89 60.96,27.94 60.01,26.99 58.42,26.99 57.15,28.26 U$1.18
+3V3  (via drill 0.35)
  Top 0.508: C9.1 NEBULA_C.9 12.38,116.2 14.92,113.67 NEBULA_C.18 17.46,113.67 18.41,112.71 18.41,112.08 17.62,111.28 | NEBULA_C.16 17.46,111.12 17.62,111.28 | C8.1 NEBULA_A.9 8.26,55.24 8.41,55.09 | NEBULA_A.18 10.79,52.7 8.41,55.09 | C10.1 NEBULA_B.9 11.75,85.72 14.29,83.19 NEBULA_B.18 17.46,83.19 17.62,83.03 | 17.62,83.03 18.41,82.23 18.41,80.33 17.46,79.38 NEBULA_B.15 16.51,79.38 11.43,74.3 11.43,58.1 8.41,55.09 | 17.62,111.28 19.37,109.54 v19.37,108.27 19.37,84.77 17.62,83.03 | 81.6,112.39 81.6,111.12 NEBULA_G.16 | 81.6,112.39 81.6,113.67 NEBULA_G.18 75.56,113.67 73.03,116.2 NEBULA_G.9 71.44,116.2 69.53,118.11 v69.53,118.43 69.53,121.28 C13.1 | 81.6,112.39 NEBULA_G.17 | IC13.8 58.1,123.19 C25.1 59.69,121.28 59.69,118.43 | C24.1 58.1,115.57 IC12.8 | C23.1 58.1,107.95 IC11.8 | C22.1 58.1,100.33 IC10.8 | C21.1 58.1,92.71 IC9.8 | C20.1 58.1,85.09 IC8.8 | C19.1 58.1,77.47 IC7.8 | C18.1 58.1,69.85 IC6.8 | C17.1 58.1,62.23 IC5.8 | C16.1 58.1,54.61 IC4.8 | C14.1 58.1,39.37 IC1.8 58.74,39.05 59.69,40.01 59.69,45.09 C15.1 | C15.1 58.1,46.99 IC3.8 | C16.1 59.69,52.7 59.69,45.72 C15.1 | C17.1 59.69,60.33 59.69,53.34 C16.1 | C18.1 59.69,67.94 59.69,60.96 C17.1 | 59.69,72.39 59.69,68.58 C18.1 | 59.69,72.39 59.69,75.56 C19.1 | C20.1 59.69,83.19 59.69,76.2 C19.1 | C21.1 59.69,90.81 59.69,83.82 C20.1 | C22.1 59.69,98.42 59.69,91.44 C21.1 | C23.1 59.69,106.05 59.69,99.06 C22.1 | C24.1 59.69,113.67 59.69,106.68 C23.1 | 59.69,118.43 59.69,114.3 C24.1 | 59.69,118.43 v60.96,118.43 | NEBULA_D.9 69.53,93.34 | NEBULA_D.15 81.6,87 81.6,88.27 NEBULA_D.16 79.38,88.27 79.22,88.42 | NEBULA_D.18 80.01,90.81 78.9,89.69 | 78.9,89.69 78.74,89.53 78.74,88.9 79.22,88.42
  Top 0.508: v69.53,89.85 69.53,93.34 | 69.53,93.34 C11.1 | v78.74,89.85 78.9,89.69 | 81.6,67.31 81.6,68.58 NEBULA_E.18 79.38,68.58 | C7.1 NEBULA_E.9 74.61,71.12 77.15,68.58 79.38,68.58 | C12.1 NEBULA_F.9 75.88,48.9 78.42,46.35 NEBULA_F.18 81.6,46.35 82.23,45.72 | NEBULA_F.15 82.23,42.55 83.19,43.5 83.19,44.77 | 82.23,45.72 83.19,44.77 | 82.23,45.72 81.6,45.09 NEBULA_F.17 | 87,48.9 87,48.58 83.19,44.77 | 81.6,67.31 82.23,67.31 87,62.55 87,48.9 | 81.6,67.31 NEBULA_E.17 | 87,48.9 C34.1 NEBULA_H.9 93.98,48.9 99.06,43.81 NEBULA_H.16 99.38,43.81 | 79.22,88.42 76.83,86.04 76.83,75.25 79.38,72.71 79.38,68.58 | IC14.8 120.33,123.19 C33.1 121.92,121.28 121.92,114.3 C32.1 | C32.1 120.33,115.57 IC15.8 | C31.1 120.33,107.95 IC16.8 | C30.1 120.33,100.33 IC17.8 | C29.1 120.33,92.71 IC18.8 | C28.1 120.33,85.09 IC19.8 | C26.1 120.33,69.85 IC21.8 | C27.1 120.33,77.47 IC20.8 | IC21.8 120.97,69.53 121.92,70.48 121.92,75.56 C27.1 | C28.1 121.92,83.19 121.92,76.2 C27.1 | C29.1 121.92,90.81 121.92,83.82 C28.1 | C30.1 121.92,98.42 121.92,91.44 C29.1 | C31.1 121.92,106.05 121.92,99.06 C30.1 | C32.1 121.92,113.67 121.92,106.68 C31.1 | v111.12,4.45 111.12,3.17 R68.2 | C3.1 26.99,10.79 26.99,4.13 26.67,3.81 U$1.1 | R27.2 73.98,8.26 73.98,4.45 R26.2 74.3,4.45 | 99.38,43.81 99.38,42.55 NEBULA_H.15 99.06,42.55 99.06,25.08 77.15,3.17 75.25,3.17 74.3,4.13 74.3,4.45 | 99.38,45.72 99.38,46.35 NEBULA_H.18 | 99.38,45.72 99.38,45.09 | 99.38,45.09 99.38,43.81 | 99.38,45.09 NEBULA_H.17 | 74.3,4.45 v73.03,3.17 | IC21.8 117.47,69.85 101.92,54.29 101.92,48.26 99.38,45.72 | v61.28,72.39 59.69,72.39
  Bottom 0.508: v60.96,118.43 64.77,118.43 | 64.77,118.43 v69.53,118.43 | v19.37,108.27 54.61,108.27 64.77,118.43 | v78.74,89.85 v69.53,89.85 64.77,89.85 64.77,75.88 v61.28,72.39 | ACCESSORY_GPIO.5 124.46,12.38 118.11,6.03 112.71,6.03 v111.12,4.45 109.86,3.17 v73.03,3.17 71.12,1.27 28.89,1.27 26.67,3.49 U$1.1
+5V
  Top 1.27: LEDARRAY.3 124.46,41.27 126.36,39.37 126.36,29.21 110.17,13.02 107.95,13.02 104.14,9.21 IC2.4 104.14,8.89 102.23,6.99 102.23,3.17 C5.1 101.6,3.49 90.81,3.49 90.49,3.81 | 90.49,3.81 92.71,6.03 POWER_IN.2 | 90.49,3.81 88.58,1.91 72.39,1.91 68.9,5.4 49.53,5.4 26.67,28.26 U$1.30
+12V  (via drill 0.35)
  Top 1.27: v116.2,57.78 ULN1.10 | C2.1 103.82,13.97 C4.1 103.5,16.83 103.5,17.78 102.87,18.41 99.38,18.41 | v108.27,11.11 110.17,11.11 IC2.3 | 99.38,18.41 94.93,18.41 82.87,6.35 POWER_IN.4 | ACCESSORY.5 124.46,37.47 120.02,33.02 113.67,33.02 99.38,18.73 99.38,18.41
  Bottom 1.27: v116.2,57.78 117.16,56.83 126.05,56.83 127,55.88 127,55.24 GAME_INTERFACE.12 127,54.93 127,43.81 124.78,41.59 124.46,41.59 ACCESSORY.5 | v108.27,11.11 105.41,8.26 84.77,8.26 82.87,6.35 POWER_IN.4
A0  (via drill 0.35)
  Top 0.305: 24.13,44.45 24.13,45.72 19.37,50.48 19.37,54.61 17.46,56.52 NEBULA_A.21 | 24.13,44.45 24.13,43.18 D2.A | 24.13,44.45 v24.77,44.45
  Bottom 0.305: v24.77,44.45 26.04,43.18 40.64,43.18 41.91,41.91 STAR_1.2
A1  (via drill 0.35)
  Top 0.305: v29.21,44.13 28.26,43.18 D3.A | NEBULA_A.22 17.46,57.78 21.59,53.66 v21.59,51.75
  SIGNAL3 0.305: v29.21,44.13 v21.59,51.75
  Bottom 0.305: v29.21,44.13 29.53,43.81 41.91,43.81 43.81,41.91 STAR_1.3
A2  (via drill 0.35)
  Top 0.305: v33.02,42.23 32.07,43.18 D4.A | NEBULA_A.23 17.78,59.05 v18.41,58.42
  SIGNAL3 0.305: v18.41,58.42 33.02,43.81 v33.02,42.23
  Bottom 0.305: v33.02,42.23 34.61,40.64 44.45,40.64 45.72,41.91 STAR_1.4
A3  (via drill 0.35)
  Top 0.305: D5.A 46.67,43.18 47.94,41.91 STAR_1.5 | NEBULA_A.24 15.88,60.33 14.29,58.74 v14.29,55.56
  Bottom 0.305: v14.29,55.56 13.97,55.88 13.02,55.88 12.06,54.93 12.06,37.47 43.5,37.47 47.94,41.91 STAR_1.5
A4  (via drill 0.35)
  Top 0.305: NEBULA_A.25 17.46,61.59 19.37,59.69 19.37,57.15 24.13,52.39 24.13,50.8 D6.A 24.45,50.8 v25.4,49.85
  Bottom 0.305: v25.4,49.85 32.38,49.85 33.34,50.8 40.64,50.8 41.91,49.53 STAR_2.2
A5  (via drill 0.35)
  Top 0.305: NEBULA_A.26 17.46,62.87 20,60.33 20,57.47 22.23,55.24 23.5,55.24 27.94,50.8 D7.A 28.26,50.8 v29.21,51.75
  Bottom 0.305: v29.21,51.75 29.84,51.12 32.7,51.12 33.02,51.44 41.91,51.44 43.81,49.53 STAR_2.3
A6  (via drill 0.35)
  Top 0.305: D8.A 44.45,50.8 45.72,49.53 STAR_2.4 | NEBULA_A.27 15.88,64.14 13.34,61.59 v13.34,54.93
  Bottom 0.305: v13.34,54.93 12.7,54.29 12.7,48.58 38.73,48.58 39.05,48.26 44.45,48.26 45.72,49.53 STAR_2.4
A7  (via drill 0.35)
  Top 0.305: v30.48,52.07 31.75,50.8 D9.A | NEBULA_A.28 15.88,65.41 12.38,61.91 12.38,54.61 13.02,53.98 v13.97,53.98
  Bottom 0.305: 31.11,52.7 31.75,53.34 44.13,53.34 47.94,49.53 STAR_2.5 | 31.11,52.7 v30.48,52.07 | v13.97,53.98 15.24,52.7 31.11,52.7
A8  (via drill 0.35)
  Top 0.305: v25.4,57.47 24.45,58.42 D10.A 24.13,58.42 18.41,64.14 v18.41,66.04 | v9.21,65.41 NEBULA_A.1
  Bottom 0.305: v25.4,57.47 26.35,58.42 40.64,58.42 41.91,57.15 STAR_3.2 | v9.21,65.41 9.84,66.04 v18.41,66.04
A9  (via drill 0.35)
  Top 0.305: D11.A 28.26,58.42 v29.21,59.37 25.72,59.37 21.27,63.82 v20.64,63.82 | v9.21,64.14 NEBULA_A.2
  Bottom 0.305: v29.21,59.37 29.53,59.05 41.91,59.05 43.81,57.15 STAR_3.3 | v9.21,64.14 9.53,63.82 v20.64,63.82
A10  (via drill 0.35)
  Top 0.305: v42.86,59.37 33.02,59.37 32.07,58.42 D12.A | NEBULA_A.3 8.26,62.87 v9.21,61.91
  Bottom 0.305: STAR_3.4 45.72,57.15 44.45,58.42 43.81,58.42 v42.86,59.37 42.55,59.69 32.7,59.69 32.07,60.33 10.79,60.33 v9.21,61.91
A11  (via drill 0.35)
  Top 0.305: D13.A 46.67,58.42 47.94,57.15 STAR_3.5 | NEBULA_A.4 6.67,61.59 4.76,59.69 v4.76,57.47
  Bottom 0.305: v4.76,57.47 5.71,56.52 38.42,56.52 39.05,55.88 46.67,55.88 47.94,57.15 STAR_3.5
A12  (via drill 0.35)
  Top 0.305: v24.13,67.31 24.13,66.04 D14.A | v9.53,60.33 NEBULA_A.5
  SIGNAL3 0.305: v9.53,60.33 15.88,60.33 22.86,67.31 v24.13,67.31
  Bottom 0.305: v24.13,67.31 25.4,66.04 40.64,66.04 41.91,64.77 STAR_4.2
A13  (via drill 0.35)
  Top 0.305: v29.21,66.99 28.26,66.04 D15.A | v9.21,59.05 NEBULA_A.6
  Bottom 0.305: STAR_4.3 43.81,64.77 41.91,66.67 29.53,66.67 v29.21,66.99 27.94,68.26 4.76,68.26 4.76,58.74 5.4,58.1 8.26,58.1 v9.21,59.05
A14  (via drill 0.35)
  Top 0.305: v33.02,65.09 32.07,66.04 D16.A | NEBULA_A.7 9.21,57.78 10.48,59.05 v10.48,64.77
  Bottom 0.305: STAR_4.4 45.72,64.77 44.45,63.5 34.61,63.5 v33.02,65.09 10.79,65.09 v10.48,64.77
A15  (via drill 0.35)
  Top 0.305: D17.A 46.67,66.04 47.94,64.77 STAR_4.5 | NEBULA_A.8 6.67,56.52 5.71,57.47 v5.71,59.05
  Bottom 0.305: v5.71,59.05 5.71,62.87 23.18,62.87 24.13,61.91 45.09,61.91 47.94,64.77 STAR_4.5
B0  (via drill 0.35)
  Top 0.305: v25.4,72.71 24.45,73.66 D18.A | NEBULA_B.21 15.88,87 13.97,85.09 v13.97,84.77
  SIGNAL3 0.305: v13.97,84.77 13.97,83.82 25.08,72.71 v25.4,72.71
  Bottom 0.305: v25.4,72.71 26.35,73.66 40.64,73.66 41.91,72.39 STAR_5.2
B1  (via drill 0.35)
  Top 0.305: v29.21,74.61 28.26,73.66 D19.A | v18.41,88.27 NEBULA_B.22
  SIGNAL3 0.305: v18.41,88.27 18.41,86.68 29.21,75.88 v29.21,74.61
  Bottom 0.305: v29.21,74.61 29.53,74.3 41.91,74.3 43.81,72.39 STAR_5.3
B2  (via drill 0.35)
  Top 0.305: v33.02,72.71 32.07,73.66 D20.A | NEBULA_B.23 15.88,89.53 v14.92,88.58
  SIGNAL3 0.305: v14.92,88.58 14.92,87.63 29.84,72.71 v33.02,72.71
  Bottom 0.305: v33.02,72.71 34.61,71.12 44.45,71.12 45.72,72.39 STAR_5.4
B3  (via drill 0.35)
  Top 0.305: D21.A 46.67,73.66 47.94,72.39 STAR_5.5 | NEBULA_B.24 17.46,90.81 18.41,89.85 v18.41,89.53
  SIGNAL3 0.305: v18.41,89.53 27.3,89.53 43.18,73.66 46.67,73.66 47.94,72.39 STAR_5.5
B4  (via drill 0.35)
  Top 0.305: v25.4,78.42 25.4,80.33 24.45,81.28 D22.A 24.13,81.28 20.32,85.09 v20.32,91.44 | v18.41,92.08 NEBULA_B.25
  Bottom 0.305: v25.4,78.42 25.72,78.74 40.64,78.74 41.91,80.01 STAR_6.2 | v18.41,92.08 19.05,91.44 v20.32,91.44
B5  (via drill 0.35)
  Top 0.305: v29.21,82.23 28.26,81.28 D23.A | NEBULA_B.26 15.88,93.34 15.24,92.71 13.34,92.71 v13.02,93.03
  Bottom 0.305: 30.16,81.28 v29.21,82.23 | 30.16,81.28 42.55,81.28 43.81,80.01 STAR_6.3 | v13.02,93.03 12.06,92.08 12.06,81.28 30.16,81.28
B6  (via drill 0.35)
  Top 0.305: v33.02,82.23 32.07,81.28 D24.A | NEBULA_B.27 15.88,94.61 v14.92,93.66
  Bottom 0.305: STAR_6.4 45.72,80.01 43.81,81.92 33.34,81.92 v33.02,82.23 32.07,83.19 25.72,83.19 23.18,85.72 12.7,85.72 12.7,91.44 v14.92,93.66
B7  (via drill 0.35)
  Top 0.305: D25.A 46.67,81.28 47.94,80.01 STAR_6.5 | v12.38,95.89 NEBULA_B.28
  Bottom 0.305: v12.38,95.89 8.26,91.76 8.26,77.47 45.4,77.47 47.94,80.01 STAR_6.5
B8  (via drill 0.35)
  Top 0.305: v21.59,91.44 24.13,88.9 D26.A | v14.29,94.61 10.79,94.61 9.53,95.89 NEBULA_B.1
  SIGNAL3 0.305: v39.69,89.85 41.91,87.63 STAR_7.2
  Bottom 0.305: v14.29,94.61 18.41,94.61 v21.59,91.44 38.1,91.44 v39.69,89.85
B9  (via drill 0.35)
  Top 0.305: v29.21,89.85 28.26,88.9 D27.A | NEBULA_B.2 9.84,94.61 v13.65,90.81
  Bottom 0.305: STAR_7.3 43.81,87.63 42.55,88.9 30.16,88.9 v29.21,89.85 28.57,90.49 13.97,90.49 v13.65,90.81
B10  (via drill 0.35)
  Top 0.305: v33.02,87.95 32.07,88.9 D28.A | NEBULA_B.3 8.89,93.34 v13.65,88.58
  Bottom 0.305: 33.66,87.31 v33.02,87.95 | 33.66,87.31 38.1,87.31 39.05,86.36 44.45,86.36 45.72,87.63 STAR_7.4 | v13.65,88.58 14.92,87.31 33.66,87.31
B11  (via drill 0.35)
  Top 0.305: D29.A 42.55,88.9 43.18,89.53 46.04,89.53 47.94,87.63 STAR_7.5 | NEBULA_B.4 8.89,92.08 v13.65,87.31
  Bottom 0.305: v13.65,87.31 14.29,86.68 37.78,86.68 38.73,85.72 46.04,85.72 47.94,87.63 STAR_7.5
B12  (via drill 0.35)
  Top 0.305: v25.4,95.57 24.45,96.52 D30.A | NEBULA_B.5 8.89,90.81 v9.21,90.49
  Bottom 0.305: STAR_8.2 41.91,95.25 40.64,93.98 26.99,93.98 v25.4,95.57 13.34,95.57 13.34,94.61 v9.21,90.49
B13  (via drill 0.35)
  Top 0.305: v29.21,97.47 28.26,96.52 D31.A | NEBULA_B.6 6.67,89.53 6.03,90.17 v6.03,96.84
  Bottom 0.305: STAR_8.3 43.81,95.25 42.55,96.52 30.16,96.52 v29.21,97.47 6.67,97.47 v6.03,96.84
B14  (via drill 0.35)
  Top 0.305: v32.07,97.79 32.07,96.52 D32.A | NEBULA_B.7 6.67,88.27 5.08,89.85 5.08,97.16 v6.03,98.11
  Bottom 0.305: STAR_8.4 45.72,95.25 43.81,97.16 32.7,97.16 v32.07,97.79 31.43,98.42 6.35,98.42 v6.03,98.11
B15  (via drill 0.35)
  Top 0.305: D33.A 46.67,96.52 47.94,95.25 STAR_8.5 | v5.71,87 NEBULA_B.8
  Bottom 0.305: v5.71,87 5.71,95.89 4.76,96.84 4.76,99.06 44.13,99.06 47.94,95.25 STAR_8.5
C0  (via drill 0.35)
  Top 0.305: NEBULA_C.21 17.46,117.47 19.37,115.57 19.37,110.49 24.13,105.73 v24.13,105.41 24.13,104.14 D34.A
  Bottom 0.305: v24.13,105.41 25.4,104.14 40.64,104.14 41.91,102.87 STAR_9.2
C1  (via drill 0.35)
  Top 0.305: v29.21,105.09 28.26,104.14 D35.A | NEBULA_C.22 17.46,118.75 v21.59,114.62
  SIGNAL3 0.305: v21.59,114.62 21.59,112.71 v29.21,105.09
  Bottom 0.305: v29.21,105.09 29.53,104.78 41.91,104.78 43.81,102.87 STAR_9.3
C2  (via drill 0.35)
  Top 0.305: v33.02,103.19 32.07,104.14 D36.A | NEBULA_C.23 17.78,120.02 v18.41,119.38
  SIGNAL3 0.305: v18.41,119.38 33.02,104.78 v33.02,103.19
  Bottom 0.305: v33.02,103.19 34.61,101.6 44.45,101.6 45.72,102.87 STAR_9.4
C3  (via drill 0.35)
  Top 0.305: D37.A 46.67,104.14 47.94,102.87 STAR_9.5 | NEBULA_C.24 15.88,121.28 15.24,120.65 15.24,115.25 v14.92,114.94
  Bottom 0.305: v14.92,114.94 18.41,111.44 18.41,106.36 44.45,106.36 47.94,102.87 STAR_9.5
C4  (via drill 0.35)
  Top 0.305: 18.1,121.92 17.46,122.56 NEBULA_C.25 | 18.1,121.92 19.37,120.65 19.37,118.11 24.13,113.35 24.13,111.76 D38.A | 18.1,121.92 v19.05,122.87
  SIGNAL3 0.305: v19.05,122.87 27.94,113.98 38.42,113.98 41.91,110.49 STAR_10.2
C5  (via drill 0.35)
  Top 0.305: v29.21,112.71 28.26,111.76 D39.A | NEBULA_C.26 12.38,123.83 v11.75,124.46
  Bottom 0.305: STAR_10.3 43.81,110.49 42.55,111.76 30.16,111.76 v29.21,112.71 22.23,112.71 19.05,115.89 9.21,115.89 9.21,122.24 10.16,123.19 10.48,123.19 v11.75,124.46
C6  (via drill 0.35)
  Top 0.305: NEBULA_C.27 18.1,125.09 20,123.19 20,118.43 23.81,114.62 28.89,114.62 31.75,111.76 D40.A 32.07,111.76 v33.02,110.81
  Bottom 0.305: v33.02,110.81 34.61,109.22 44.45,109.22 45.72,110.49 STAR_10.4
C7  (via drill 0.35)
  Top 0.305: D41.A 46.67,111.76 47.94,110.49 STAR_10.5 | v14.92,126.36 NEBULA_C.28
  Bottom 0.305: v14.92,126.36 11.11,122.56 10.48,122.56 9.84,121.92 9.84,117.16 36.83,117.16 41.59,112.39 46.04,112.39 47.94,110.49 STAR_10.5
C8  (via drill 0.35)
  Top 0.305: 24.13,120.33 24.13,120.97 17.78,127.32 8.57,127.32 7.62,126.36 NEBULA_C.1 | 24.13,120.33 24.13,119.38 D42.A | 24.13,120.33 v25.4,120.33
  Bottom 0.305: v25.4,120.33 26.67,119.06 38.42,119.06 38.73,119.38 40.64,119.38 41.91,118.11 STAR_11.2
C9  (via drill 0.35)
  Top 0.305: v32.07,120.65 32.07,119.38 D43.A | NEBULA_C.2 9.84,125.09 v14.29,120.65
  Bottom 0.305: v32.07,120.65 33.02,119.7 38.1,119.7 38.42,120.02 41.91,120.02 43.81,118.11 | v14.29,120.65 16.51,118.43 37.47,118.43 39.05,116.84 42.55,116.84 43.81,118.11 | 43.81,118.11 STAR_11.3
C10  (via drill 0.35)
  Top 0.305: D44.A 44.45,119.38 45.72,118.11 STAR_11.4 | NEBULA_C.3 9.84,123.83 v13.02,120.65
  Bottom 0.305: v13.02,120.65 15.88,117.79 37.15,117.79 38.73,116.2 43.81,116.2 45.72,118.11 STAR_11.4
C11  (via drill 0.35)
  Top 0.305: v30.16,121.28 28.26,119.38 D45.A | NEBULA_C.4 9.84,122.56 v10.79,121.6
  Bottom 0.305: 30.48,121.6 v30.16,121.28 | 30.48,121.6 44.45,121.6 47.94,118.11 STAR_11.5 | 30.48,121.6 v10.79,121.6
C12  (via drill 0.35)
  Top 0.305: NEBULA_C.5 6.67,121.28 6.03,121.92 6.03,127 6.99,127.95 23.18,127.95 24.13,127 D46.A 24.45,127 v25.4,126.05
  Bottom 0.305: v25.4,126.05 26.99,124.46 40.64,124.46 41.91,125.73 STAR_12.2
C13  (via drill 0.35)
  Top 0.305: NEBULA_C.6 6.67,120.02 5.4,121.28 5.4,127.32 7.3,129.22 25.72,129.22 27.94,127 D47.A 28.26,127 v29.21,127.95
  Bottom 0.305: v29.21,127.95 30.16,127 42.55,127 43.81,125.73 STAR_12.3
C14  (via drill 0.35)
  Top 0.305: v33.02,127.95 32.07,127 D48.A 31.75,127 28.89,129.86 6.99,129.86 4.13,127 4.13,121.28 6.67,118.75 NEBULA_C.7
  Bottom 0.305: v33.02,127.95 33.34,127.64 43.81,127.64 45.72,125.73 STAR_12.4
C15
  Top 0.305: STAR_12.5 47.94,125.73 46.67,127 D49.A 35.56,127 32.07,130.49 6.67,130.49 2.86,126.68 2.86,120.65 6.03,117.47 NEBULA_C.8
D0  (via drill 0.35)
  Top 0.305: v83.5,127 D1.A | NEBULA_D.21 77.79,94.61 76.2,96.2 v76.2,100.65
  SIGNAL3 0.305: v76.2,100.65 76.2,116.52 75.88,116.84 75.88,120.97 81.92,127 v83.5,127
  Bottom 0.305: v83.5,127 102.87,127 104.14,125.73 STAR_13.2
D1  (via drill 0.35)
  Top 0.305: v87.63,126.05 88.58,127 D50.A | NEBULA_D.22 80.33,95.89 79.38,96.84 77.47,96.84 v77.15,96.52
  SIGNAL3 0.305: v77.15,96.52 75.25,98.42 75.25,123.19 80.01,127.95 85.72,127.95 v87.63,126.05
  Bottom 0.305: v87.63,126.05 89.22,124.46 104.78,124.46 106.05,125.73 STAR_13.3
D2  (via drill 0.35)
  Top 0.305: D51.A 92.39,127 91.44,126.05 91.44,124.46 93.03,122.87 105.09,122.87 107.95,125.73 STAR_13.4 | NEBULA_D.23 80.33,97.16 v79.06,98.42
  SIGNAL3 0.305: v79.06,98.42 77.79,99.69 77.79,114.62 83.5,120.33 87,120.33 93.66,127 106.68,127 107.95,125.73 STAR_13.4
D3  (via drill 0.35)
  Top 0.305: D52.A 96.52,127 97.47,127.95 107.95,127.95 110.17,125.73 STAR_13.5 | NEBULA_D.24 80.64,98.42 v78.74,100.33
  SIGNAL3 0.305: v78.74,100.33 79.38,100.33 82.23,103.19 82.23,113.03 89.22,120.02 89.22,121.6 92.08,124.46 108.9,124.46 110.17,125.73 STAR_13.5
D4  (via drill 0.35)
  Top 0.305: v83.82,119.06 84.77,120.02 D53.A | NEBULA_D.25 80.64,99.69 79.69,100.65 v79.69,101.92
  SIGNAL3 0.305: v79.69,101.92 79.69,102.87 81.6,104.78 81.6,116.84 v83.82,119.06
  Bottom 0.305: v83.82,119.06 84.14,119.38 102.87,119.38 104.14,118.11 STAR_14.2
D5  (via drill 0.35)
  Top 0.305: v90.17,121.28 88.9,120.02 D54.A | v83.5,100.97 NEBULA_D.26
  SIGNAL3 0.305: v83.5,100.97 90.17,107.63 v90.17,121.28
  Bottom 0.305: v90.17,121.28 91.44,120.02 104.14,120.02 106.05,118.11 STAR_14.3
D6  (via drill 0.35)
  Top 0.305: NEBULA_D.27 80.64,102.23 80.01,102.87 v80.01,104.46 | 91.76,117.16 93.03,115.89 105.73,115.89 107.95,118.11 STAR_14.4 | 91.76,117.16 91.44,117.47 91.44,119.06 92.39,120.02 D55.A | v88.58,113.67 91.76,116.84 91.76,117.16
  $GND 0.305: v80.01,104.46 80.01,105.09 v88.58,113.67
D7  (via drill 0.35)
  Top 0.305: D56.A 96.52,120.02 97.47,120.97 107.31,120.97 110.17,118.11 STAR_14.5 | NEBULA_D.28 82.23,103.5 v83.5,102.23
  SIGNAL3 0.305: v83.5,102.23 82.55,101.28 82.55,100.65 83.19,100.01 86.36,100.01 103.19,116.84 108.9,116.84 110.17,118.11 STAR_14.5
D8  (via drill 0.35)
  Top 0.305: v83.19,112.39 D57.A | v73.03,105.73 73.03,104.14 72.39,103.5 NEBULA_D.1
  $GND 0.305: v83.19,112.39 83.19,113.67 85.09,115.57 99.69,115.57 104.14,111.12 104.14,110.49 STAR_15.2
  Bottom 0.305: v83.19,112.39 81.6,110.81 78.11,110.81 v73.03,105.73
D9  (via drill 0.35)
  Top 0.305: D58.A 88.9,112.39 89.85,113.35 94.93,113.35 95.25,113.03 95.25,109.86 96.84,108.27 103.82,108.27 106.05,110.49 STAR_15.3 | v73.98,102.23 NEBULA_D.2
  Bottom 0.305: v73.98,102.23 73.98,105.73 78.42,110.17 100.33,110.17 101.28,109.22 104.78,109.22 106.05,110.49 STAR_15.3
D10  (via drill 0.35)
  Top 0.305: NEBULA_D.3 73.98,100.97 79.38,106.36 v85.41,106.36 | 92.08,108.27 93.34,107 104.46,107 107.95,110.49 STAR_15.4 | 92.08,108.27 91.44,108.9 91.44,111.44 92.39,112.39 D59.A | v90.81,106.68 92.08,107.95 92.08,108.27
  $GND 0.254: v85.41,106.36 88.27,106.36 91.44,109.54
  Bottom 0.305: v85.41,106.36 85.72,106.68 v90.81,106.68
D11  (via drill 0.35)
  Top 0.305: D60.A 96.52,112.39 97.47,113.35 107.31,113.35 110.17,110.49 STAR_15.5 | v73.98,99.69 NEBULA_D.4
  Bottom 0.305: v73.98,99.69 79.06,104.78 79.06,108.27 107.95,108.27 110.17,110.49 STAR_15.5
D12  (via drill 0.35)
  Top 0.305: D61.A v83.5,104.14 82.87,104.14 81.28,105.73 79.69,105.73 74.93,100.97 74.93,99.38 73.98,98.42 NEBULA_D.5
  Bottom 0.305: v83.5,104.14 102.87,104.14 104.14,102.87 STAR_16.2
D13  (via drill 0.35)
  Top 0.305: v90.17,105.41 88.9,104.14 D62.A | v73.98,97.16 NEBULA_D.6
  Bottom 0.305: STAR_16.3 106.05,102.87 104.14,104.78 90.81,104.78 v90.17,105.41 83.5,105.41 80.96,102.87 78.11,102.87 78.11,101.28 v73.98,97.16
D14  (via drill 0.35)
  Top 0.305: D63.A 92.39,104.14 91.44,103.19 91.44,101.6 93.03,100.01 105.09,100.01 107.95,102.87 STAR_16.4 | v73.98,95.89 NEBULA_D.7
  Bottom 0.305: v73.98,95.89 77.47,99.38 91.12,99.38 93.34,101.6 106.68,101.6 107.95,102.87 STAR_16.4
D15  (via drill 0.35)
  Top 0.305: D64.A 96.52,104.14 97.47,105.09 107.95,105.09 110.17,102.87 STAR_16.5 | v73.98,94.61 NEBULA_D.8
  Bottom 0.305: v73.98,94.61 76.83,97.47 90.17,97.47 93.66,100.97 108.27,100.97 110.17,102.87 STAR_16.5
E0  (via drill 0.35)
  Top 0.305: v87.63,95.57 87.63,97.16 87.31,97.47 86.04,97.47 85.09,96.52 D65.A | NEBULA_E.21 80.64,72.39 77.79,75.25 77.79,85.72 v79.38,87.31
  SIGNAL3 0.305: v87.63,95.57 v79.38,87.31
  Bottom 0.305: v87.63,95.57 89.22,93.98 102.87,93.98 104.14,95.25 STAR_17.2
E1  (via drill 0.35)
  Top 0.305: v91.44,97.47 89.85,97.47 88.9,96.52 D66.A | NEBULA_E.22 82.23,73.66 83.19,72.71 v83.19,71.12
  SIGNAL3 0.305: v83.19,71.12 83.19,72.07 106.36,95.25 STAR_17.3
  Bottom 0.305: v91.44,97.47 92.39,96.52 104.78,96.52 106.05,95.25 STAR_17.3
E2  (via drill 0.35)
  Top 0.305: v93.98,97.79 92.71,96.52 D67.A | NEBULA_E.23 82.23,74.93 83.19,75.88 v83.19,76.52
  SIGNAL3 0.305: v83.19,76.52 83.19,78.42 93.98,89.22 v93.98,97.79
  Bottom 0.305: v93.98,97.79 94.61,97.16 106.05,97.16 107.95,95.25 STAR_17.4
E3  (via drill 0.35)
  Top 0.305: D68.A 96.52,96.52 97.47,97.47 107.95,97.47 110.17,95.25 STAR_17.5 | NEBULA_E.24 80.64,76.2 78.42,78.42 78.42,84.77 79.69,86.04 82.55,86.04 83.19,86.68 v83.19,92.71
  Bottom 0.305: v83.19,92.71 83.82,93.34 108.27,93.34 110.17,95.25 STAR_17.5
E4  (via drill 0.35)
  Top 0.305: 87.63,90.49 101.28,90.49 104.14,87.63 STAR_18.2 | 87.63,90.49 86.68,90.49 85.09,88.9 D69.A | NEBULA_E.25 80.64,77.47 79.06,79.06 79.06,84.14 v80.01,85.09 | 87.63,90.49 v87.63,89.85
  Bottom 0.305: v80.01,85.09 84.77,89.85 v87.63,89.85
E5  (via drill 0.35)
  Top 0.305: v95.25,87.95 95.25,89.53 94.93,89.85 89.85,89.85 88.9,88.9 D70.A 88.58,88.9 v87.63,87.95 | NEBULA_E.26 80.64,78.74 80.01,79.38 v80.01,83.82
  Bottom 0.305: v95.25,87.95 96.2,88.9 104.78,88.9 106.05,87.63 STAR_18.3 | v80.01,83.82 84.14,87.95 v87.63,87.95
E6  (via drill 0.35)
  Top 0.305: v91.44,87.95 92.39,88.9 D71.A | NEBULA_E.27 82.23,80.01 83.19,80.96 v83.19,83.82
  Bottom 0.305: 93.03,86.36 v91.44,87.95 | 93.03,86.36 106.68,86.36 107.95,87.63 STAR_18.4 | v83.19,83.82 85.72,86.36 93.03,86.36
E7  (via drill 0.35)
  Top 0.305: D72.A 96.52,88.9 97.47,89.85 98.74,89.85 100.97,87.63 100.97,86.68 101.28,86.36 108.9,86.36 110.17,87.63 STAR_18.5 | v81.6,83.82 81.6,81.28 NEBULA_E.28
  Bottom 0.305: v81.6,83.82 84.77,87 89.22,87 91.76,89.53 108.27,89.53 110.17,87.63 STAR_18.5
E8  (via drill 0.35)
  Top 0.305: v86.36,83.19 85.09,81.92 D73.A | v73.98,81.28 NEBULA_E.1
  Bottom 0.305: 86.68,82.87 87.63,81.92 102.23,81.92 104.14,80.01 STAR_19.2 | 86.68,82.87 v86.36,83.19 | v73.98,81.28 75.56,82.87 86.68,82.87
E9  (via drill 0.35)
  Top 0.305: v87.63,80.96 88.58,81.92 D74.A | v73.98,80.01 NEBULA_E.2
  Bottom 0.305: STAR_19.3 106.05,80.01 104.78,78.74 101.28,78.74 99.69,80.33 88.27,80.33 v87.63,80.96 74.93,80.96 v73.98,80.01
E10  (via drill 0.35)
  Top 0.305: D75.A 92.39,81.92 91.44,80.96 91.44,79.38 93.03,77.79 105.73,77.79 107.95,80.01 STAR_19.4 | v73.98,78.74 NEBULA_E.3
  Bottom 0.305: v73.98,78.74 74.93,79.69 99.38,79.69 100.97,78.11 106.05,78.11 107.95,80.01 STAR_19.4
E11  (via drill 0.35)
  Top 0.305: D76.A 96.52,81.92 97.47,82.87 107.31,82.87 110.17,80.01 STAR_19.5 | v73.98,77.47 NEBULA_E.4
  Bottom 0.305: v73.98,77.47 107.63,77.47 110.17,80.01 STAR_19.5
E12  (via drill 0.35)
  Top 0.305: D77.A 85.09,74.3 87,76.2 93.98,76.2 95.25,74.93 95.25,71.75 96.84,70.17 101.92,70.17 104.14,72.39 STAR_20.2 | NEBULA_E.5 74.93,76.2 78.42,72.71 v78.42,72.39
  Bottom 0.305: v78.42,72.39 80.64,70.17 101.92,70.17 104.14,72.39 STAR_20.2
E13  (via drill 0.35)
  Top 0.305: v87.63,73.34 88.58,74.3 D78.A | NEBULA_E.6 74.93,74.93 v76.2,73.66
  Bottom 0.305: STAR_20.3 106.05,72.39 104.78,73.66 87.95,73.66 v87.63,73.34 76.52,73.34 v76.2,73.66
E14  (via drill 0.35)
  Top 0.305: v93.34,75.25 93.34,74.93 92.71,74.3 D79.A | v74.3,73.66 NEBULA_E.7
  Bottom 0.305: 93.66,74.93 94.3,74.3 106.05,74.3 107.95,72.39 STAR_20.4 | 93.66,74.93 v93.34,75.25 | v74.3,73.66 75.56,74.93 93.66,74.93
E15  (via drill 0.35)
  Top 0.305: D80.A 96.52,74.3 97.47,75.25 107.31,75.25 110.17,72.39 STAR_20.5 | v74.3,72.39 NEBULA_E.8
  Bottom 0.305: v74.3,72.39 77.15,69.53 106.68,69.53 108.27,71.12 108.9,71.12 110.17,72.39 STAR_20.5
F0  (via drill 0.35)
  Top 0.305: v74.3,50.16 NEBULA_F.21 | IC1.2 64.77,40.64 v65.72,41.59
  $GND 0.254: 74.61,50.48 v74.3,50.16 70.8,46.67 70.48,46.67 65.72,41.91 v65.72,41.59
F1  (via drill 0.35)
  Top 0.305: v75.56,51.44 NEBULA_F.22 | v62.23,42.86 63.18,41.91 IC1.3
  $GND 0.305: v75.56,51.44 72.39,51.44 63.82,42.86 v62.23,42.86
F2  (via drill 0.35)
  Top 0.305: v79.69,52.7 NEBULA_F.23 | v65.72,48.9 65.09,48.26 IC3.2
  Bottom 0.305: v79.69,52.7 75.88,48.9 v65.72,48.9
F3  (via drill 0.35)
  Top 0.305: v79.69,53.98 NEBULA_F.24 | v66.36,51.12 64.77,49.53 IC3.3
  Bottom 0.305: v79.69,53.98 78.11,52.39 67.63,52.39 v66.36,51.12
F4  (via drill 0.35)
  Top 0.305: v79.69,55.24 NEBULA_F.25 | v62.23,55.56 63.5,55.56 63.82,55.88 IC4.2
  Bottom 0.305: v79.69,55.24 79.38,55.56 v62.23,55.56
F5  (via drill 0.35)
  Top 0.305: v79.69,56.52 NEBULA_F.26 | v62.23,57.47 63.5,57.47 63.82,57.15 IC4.3
  Bottom 0.305: v79.69,56.52 78.74,57.47 v62.23,57.47
F6  (via drill 0.35)
  Top 0.305: v79.69,57.78 NEBULA_F.27 | v65.72,60.96 65.72,62.55 64.77,63.5 IC5.2